# EAGLE design RGBCUBEv1.0 (EAGLE 5.11)
BOM: EXCLUDE; PARTNO: 114-00841-68

## Sheet 1 of 4
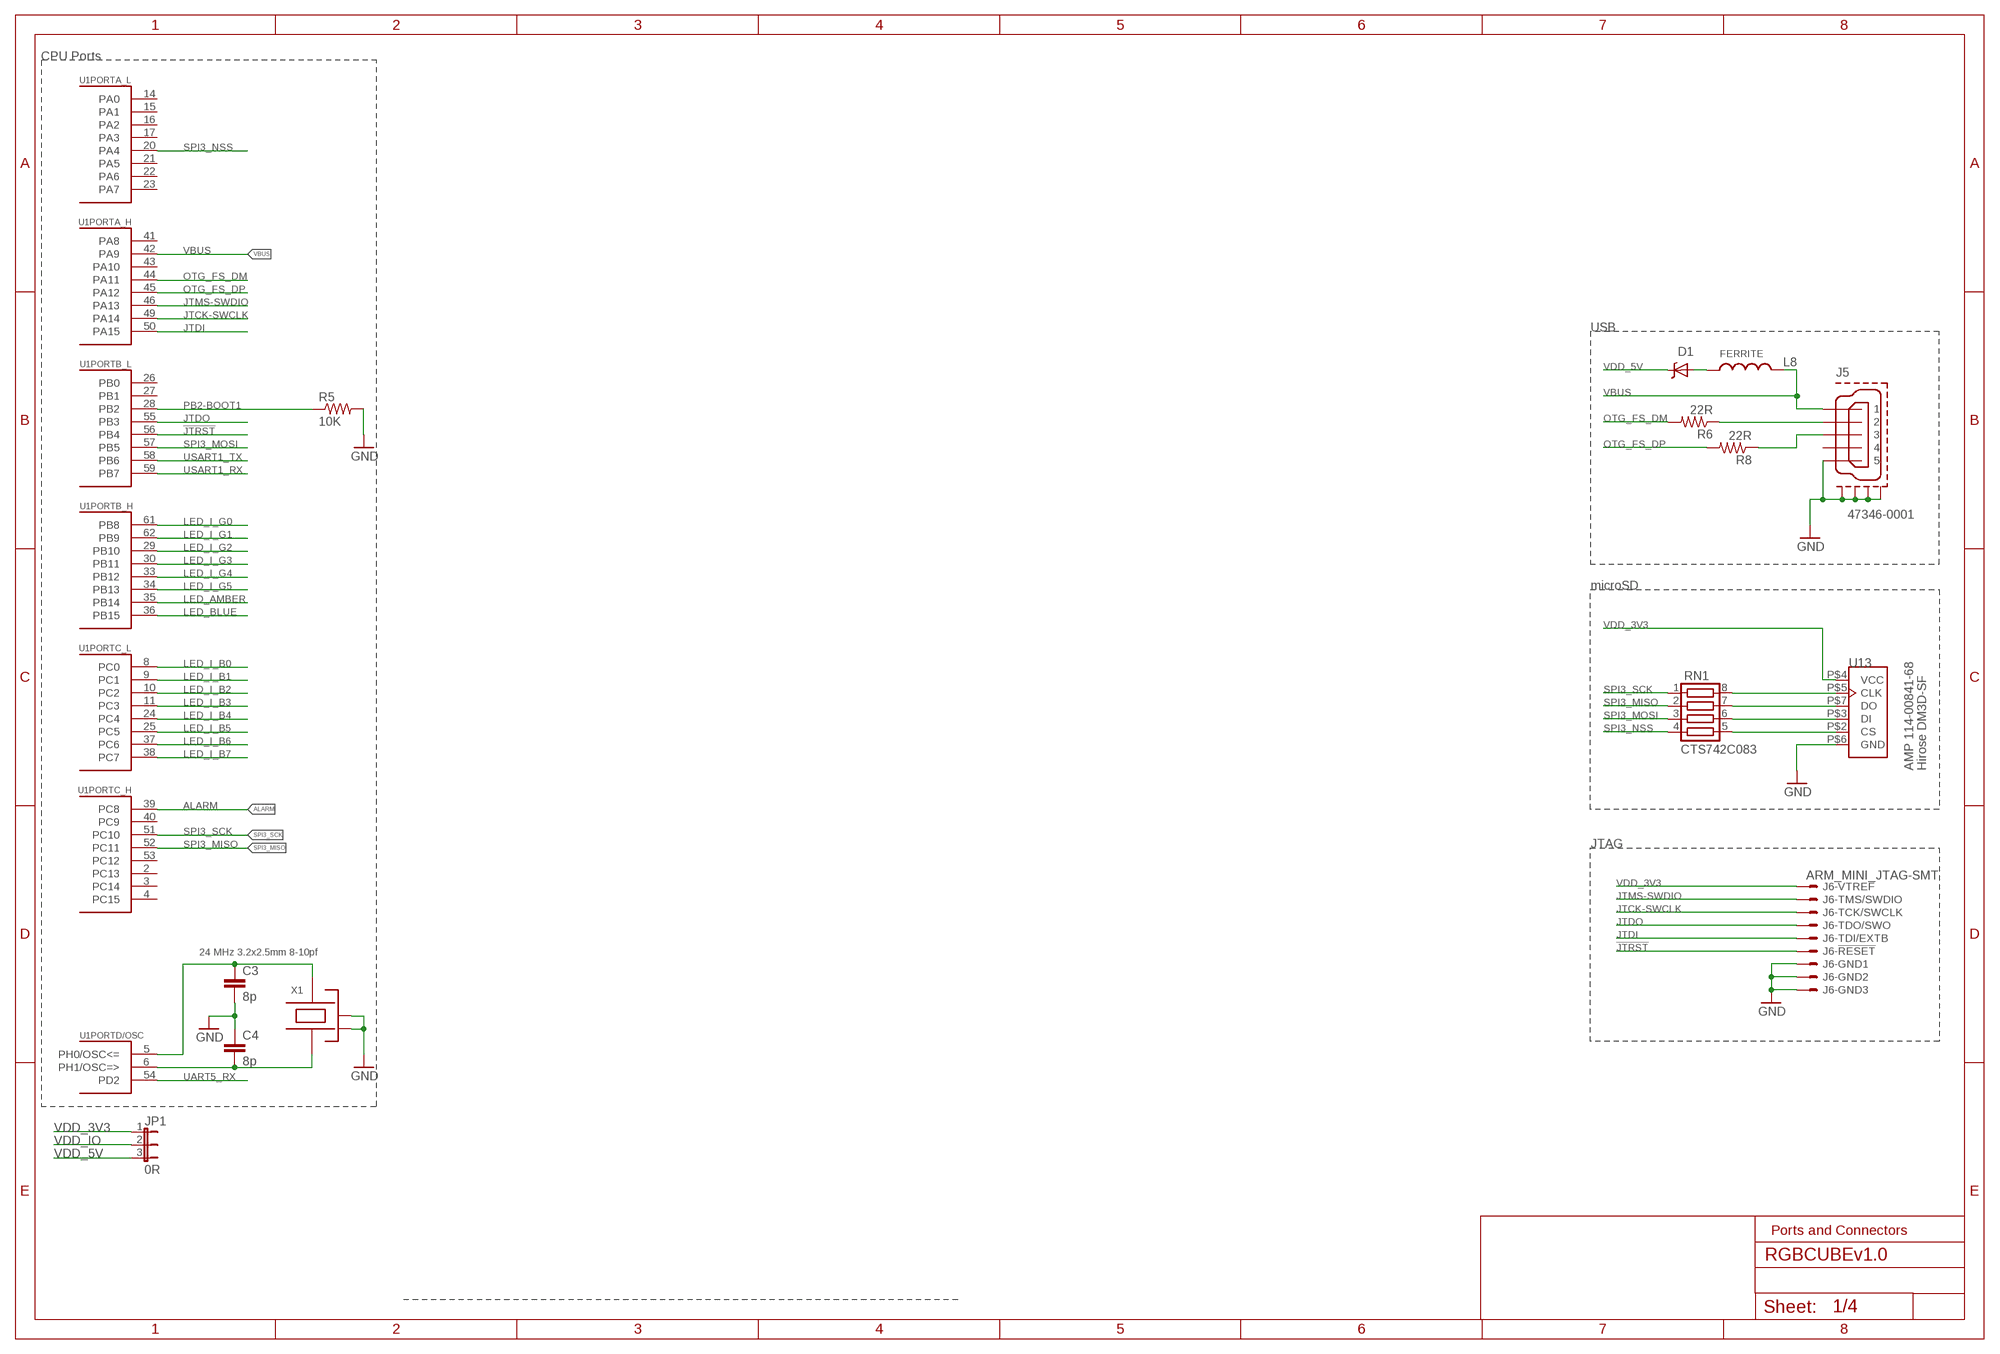
[diagram p0: schematic, sheet 1]

### Parts
C3  8p  CAP0402-CAP  [0402-CAP]
C4  8p  CAP0402-CAP  [0402-CAP]
D1  MSS1P4-M3  DIODE-SCHOTTKY_MSMP  [MICROSMP]
J5  47346-0001  MOLEX-47346-0001  [MOLEX-47346-0001]
J6  ARM_MINI_JTAG-SMT  [FTSH-105-01-XXX-DV-K]
JP1  0R  JUMPER-30603  [SJ_3_0603_PASTE1&2]
L8  FERRITE  INDUCTOR0402  [0402-IND]
R5  10K  RESISTOR0402-RES  [0402-RES]
R6  22R  RESISTOR0402-RES  [0402-RES]
R8  22R  RESISTOR0402-RES  [0402-RES]
RN1  CTS742C083  [CTS742C083]
U1  STM32F405RGT6  STM32F20X_TQFP64  [TQFP64]
U13  AMP 114-00841-68  SF-MICROSDAMP-114-00841-68  [AMPHENOL_114-00841-68]
X1  24 MHz 3.2x2.5mm 8-10pf  OSCILLATOR-3.2X2.5  [OSCILLATOR-3.2X2.5]

### Nets
!JTRST: J6.10 U1.56(PORTB_L:PB4)
ALARM: U1.39(PORTC_H:PC8)
GND [power]: C3.2 C4.1 J5.GND J5.GND1 J5.GND2 J5.GND3 J5.GND4 J6.3 J6.5 J6.9 R5.2 U13.P$6(GND) X1.2(NC_2) X1.4(NC_4) ; also sheet 2,3,4
JTCK-SWCLK: J6.4 U1.49(PORTA_H:PA14)
JTDI: J6.8 U1.50(PORTA_H:PA15)
JTDO: J6.6 U1.55(PORTB_L:PB3)
JTMS-SWDIO: J6.2 U1.46(PORTA_H:PA13)
LED_AMBER: U1.35(PORTB_H:PB14) ; also sheet 2
LED_BLUE: U1.36(PORTB_H:PB15) ; also sheet 2
LED_I_B0: U1.8(PORTC_L:PC0) ; also sheet 4
LED_I_B1: U1.9(PORTC_L:PC1) ; also sheet 4
LED_I_B2: U1.10(PORTC_L:PC2) ; also sheet 4
LED_I_B3: U1.11(PORTC_L:PC3) ; also sheet 4
LED_I_B4: U1.24(PORTC_L:PC4) ; also sheet 4
LED_I_B5: U1.25(PORTC_L:PC5) ; also sheet 4
LED_I_B6: U1.37(PORTC_L:PC6) ; also sheet 4
LED_I_B7: U1.38(PORTC_L:PC7) ; also sheet 4
LED_I_G0: U1.61(PORTB_H:PB8) ; also sheet 4
LED_I_G1: U1.62(PORTB_H:PB9) ; also sheet 4
LED_I_G2: U1.29(PORTB_H:PB10) ; also sheet 4
LED_I_G3: U1.30(PORTB_H:PB11) ; also sheet 4
LED_I_G4: U1.33(PORTB_H:PB12) ; also sheet 4
LED_I_G5: U1.34(PORTB_H:PB13) ; also sheet 4
N$1: C4.2 U1.6(PORTD/OSC:PH1/OSC=>) X1.1
N$2: C3.1 U1.5(PORTD/OSC:PH0/OSC<=) X1.3
N$21: RN1.5 U13.P$2(CS)
N$23 [power]: D1.ANODE(A) L8.1
N$26: RN1.6 U13.P$3(DI)
N$31: RN1.7 U13.P$7(DO)
N$32: RN1.8 U13.P$5(CLK)
OTG_DM: J5.D- R6.1
OTG_DP: J5.D+ R8.1
OTG_FS_DM: R6.2 U1.44(PORTA_H:PA11)
OTG_FS_DP: R8.2 U1.45(PORTA_H:PA12)
PB2-BOOT1: R5.1 U1.28(PORTB_L:PB2)
SPI3_MISO: RN1.2 U1.52(PORTC_H:PC11)
SPI3_MOSI: RN1.3 U1.57(PORTB_L:PB5)
SPI3_NSS: RN1.4 U1.20(PORTA_L:PA4)
SPI3_SCK: RN1.1 U1.51(PORTC_H:PC10)
UART5_RX: U1.54(PORTD/OSC:PD2)
USART1_RX: U1.59(PORTB_L:PB7)
USART1_TX: U1.58(PORTB_L:PB6)
VBUS [power]: J5.VBUS L8.2 U1.42(PORTA_H:PA9)
VDD_3V3 [power]: J6.1 JP1.1 U13.P$4(VCC) ; also sheet 2
VDD_5V [power]: D1.CATHODE(C) JP1.3 ; also sheet 2,3,4
VDD_IO [power]: JP1.2
Unconnected: J5.ID U1.2(PORTC_H:PC13) U1.3(PORTC_H:PC14) U1.4(PORTC_H:PC15) U1.14(PORTA_L:PA0) U1.15(PORTA_L:PA1) U1.16(PORTA_L:PA2) U1.17(PORTA_L:PA3) U1.21(PORTA_L:PA5) U1.22(PORTA_L:PA6) U1.23(PORTA_L:PA7) U1.26(PORTB_L:PB0) U1.27(PORTB_L:PB1) U1.40(PORTC_H:PC9) U1.41(PORTA_H:PA8) U1.43(PORTA_H:PA10) U1.53(PORTC_H:PC12)

### Notes on the sheet
- CPU Ports
- USB
- microSD
- Hirose DM3D-SF
- JTAG
- Ports and Connectors

## Sheet 2 of 4
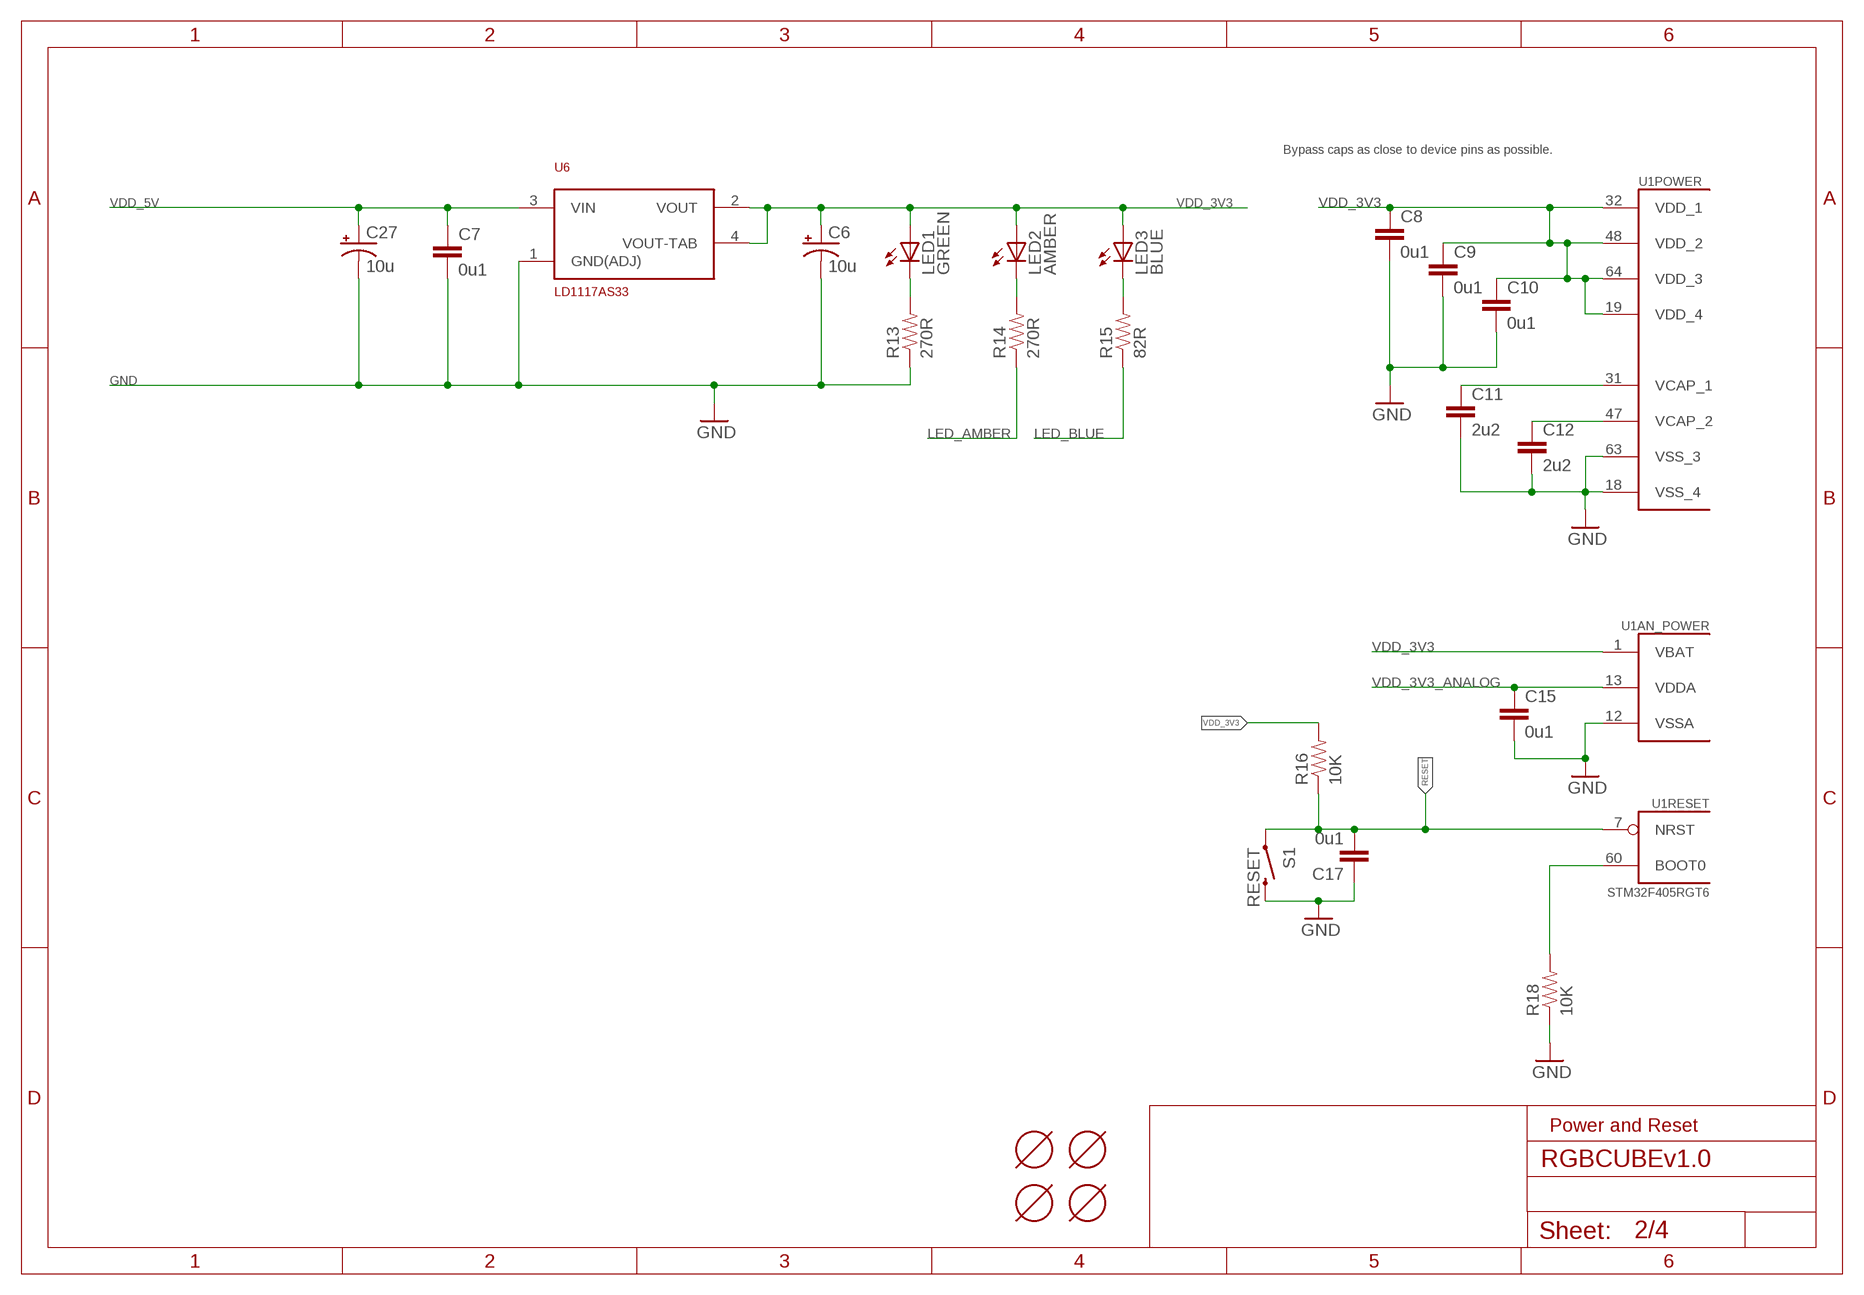
[diagram p1: schematic, sheet 2]

### Parts
C6  10u  CAP_POL1206  [EIA3216]
C7  0u1  CAP0402-CAP  [0402-CAP]
C8  0u1  CAP0402-CAP  [0402-CAP]
C9  0u1  CAP0402-CAP  [0402-CAP]
C10  0u1  CAP0402-CAP  [0402-CAP]
C11  2u2  CAP0402-CAP  [0402-CAP]
C12  2u2  CAP0402-CAP  [0402-CAP]
C15  0u1  CAP0402-CAP  [0402-CAP]
C17  0u1  CAP0402-CAP  [0402-CAP]
C27  10u  CAP_POL1206  [EIA3216]
LED1  GREEN  LED0603  [LED-0603]
LED2  AMBER  LED0603  [LED-0603]
LED3  BLUE  LED0603  [LED-0603]
R13  270R  RESISTOR0402-RES  [0402-RES]
R14  270R  RESISTOR0402-RES  [0402-RES]
R15  82R  RESISTOR0402-RES  [0402-RES]
R16  10K  RESISTOR0402-RES  [0402-RES]
R18  10K  RESISTOR0402-RES  [0402-RES]
S1  RESET  SWITCH-MOMENTARY-2  [EVQP7J01K]
U6  LD1117AS33  [SOT-223]
U$1  MOUNT-HOLE3.1MM  [MOUNT-HOLE3.1]
U$2  MOUNT-HOLE3.1MM  [MOUNT-HOLE3.1]
U$3  MOUNT-HOLE3.1MM  [MOUNT-HOLE3.1]
U$4  MOUNT-HOLE3.1MM  [MOUNT-HOLE3.1]

### Nets
BOOT0: R18.2 U1.60(RESET:BOOT0)
GND [power]: C6.C(-) C7.2 C8.2 C9.2 C10.2 C11.2 C12.2 C15.2 C17.1 C27.C(-) R13.1 R18.1 S1.B3 U1.12(AN_POWER:VSSA) U1.18(POWER:VSS_4) U1.63(POWER:VSS_3) U6.1(GND(ADJ)) ; also sheet 1,3,4
LED_AMBER: R14.1 ; also sheet 1
LED_BLUE: R15.1 ; also sheet 1
N$28: LED3.C R15.2
N$29: LED1.C R13.2
N$30: LED2.C R14.2
RESET: C17.2 R16.1 S1.A1 U1.7(RESET:NRST)
VCAP_1: C11.1 U1.31(POWER:VCAP_1)
VCAP_2: C12.1 U1.47(POWER:VCAP_2)
VDD_3V3 [power]: C6.A(+) C8.1 C9.1 C10.1 LED1.A LED2.A LED3.A R16.2 U1.1(AN_POWER:VBAT) U1.19(POWER:VDD_4) U1.32(POWER:VDD_1) U1.48(POWER:VDD_2) U1.64(POWER:VDD_3) U6.2(VOUT) U6.4(VOUT-TAB) ; also sheet 1
VDD_3V3_ANALOG [power]: C15.1 U1.13(AN_POWER:VDDA)
VDD_5V [power]: C7.1 C27.A(+) U6.3(VIN) ; also sheet 1,3,4

### Notes on the sheet
- Bypass caps as close to device pins as possible.
- Power and Reset

## Sheet 3 of 4
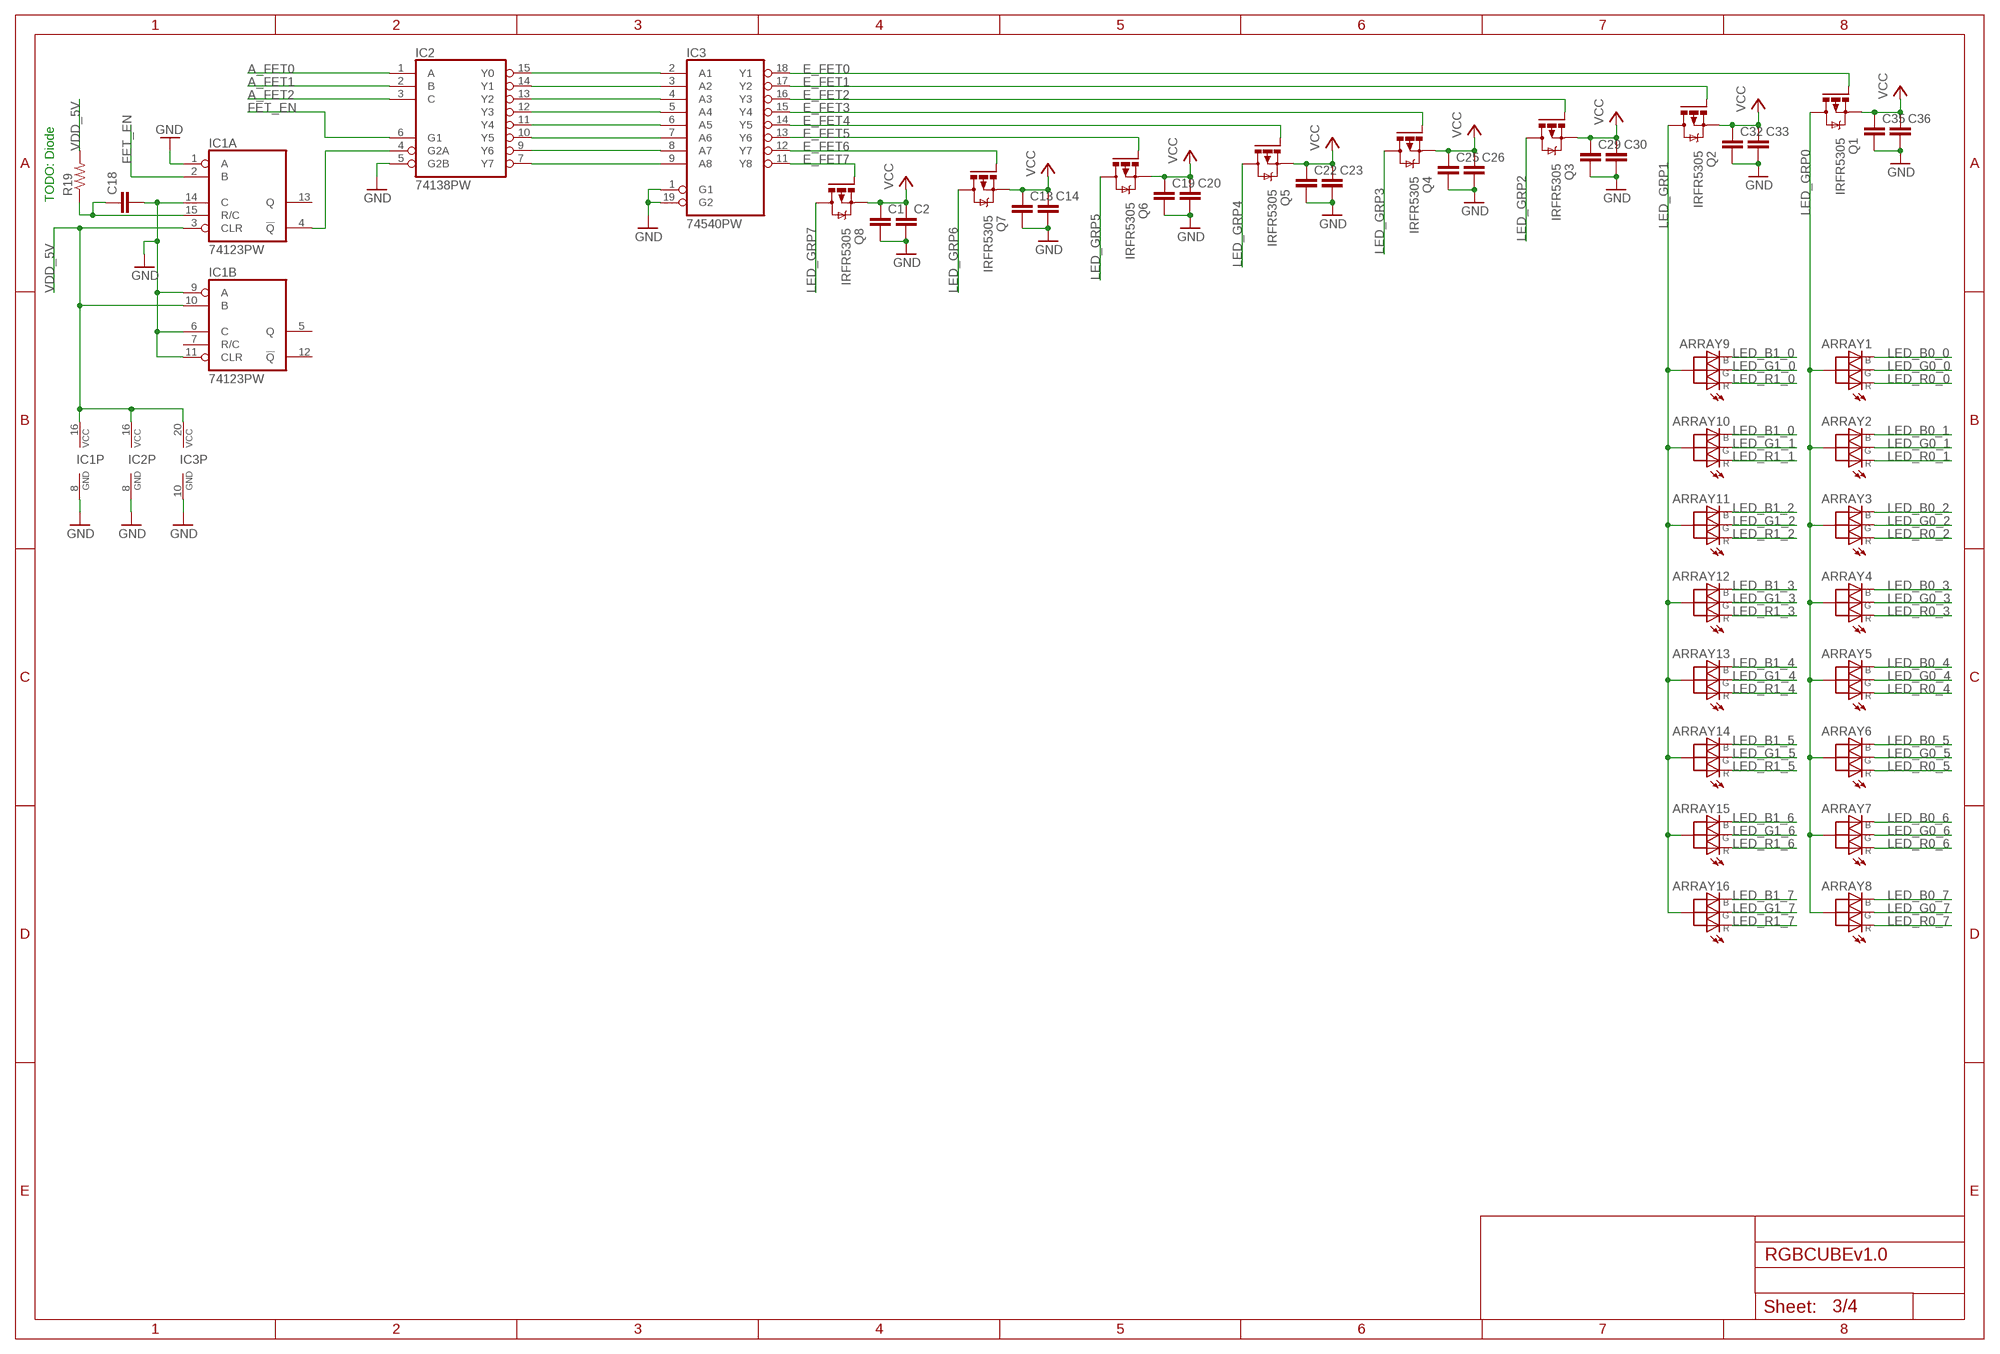
[diagram p2: schematic, sheet 3]

### Parts
ARRAY1  LED_RGB_5MMRAD  [LED_RGB_5MM_RAD]
ARRAY2  LED_RGB_5MMRAD  [LED_RGB_5MM_RAD]
ARRAY3  LED_RGB_5MMRAD  [LED_RGB_5MM_RAD]
ARRAY4  LED_RGB_5MMRAD  [LED_RGB_5MM_RAD]
ARRAY5  LED_RGB_5MMRAD  [LED_RGB_5MM_RAD]
ARRAY6  LED_RGB_5MMRAD  [LED_RGB_5MM_RAD]
ARRAY7  LED_RGB_5MMRAD  [LED_RGB_5MM_RAD]
ARRAY8  LED_RGB_5MMRAD  [LED_RGB_5MM_RAD]
ARRAY9  LED_RGB_5MMRAD  [LED_RGB_5MM_RAD]
ARRAY10  LED_RGB_5MMRAD  [LED_RGB_5MM_RAD]
ARRAY11  LED_RGB_5MMRAD  [LED_RGB_5MM_RAD]
ARRAY12  LED_RGB_5MMRAD  [LED_RGB_5MM_RAD]
ARRAY13  LED_RGB_5MMRAD  [LED_RGB_5MM_RAD]
ARRAY14  LED_RGB_5MMRAD  [LED_RGB_5MM_RAD]
ARRAY15  LED_RGB_5MMRAD  [LED_RGB_5MM_RAD]
ARRAY16  LED_RGB_5MMRAD  [LED_RGB_5MM_RAD]
C1  CAP0805  [0805]
C2  CAP0805  [0805]
C13  CAP0805  [0805]
C14  CAP0805  [0805]
C18  C-EUC0402  [C0402]
C19  CAP0805  [0805]
C20  CAP0805  [0805]
C22  CAP0805  [0805]
C23  CAP0805  [0805]
C25  CAP0805  [0805]
C26  CAP0805  [0805]
C29  CAP0805  [0805]
C30  CAP0805  [0805]
C32  CAP0805  [0805]
C33  CAP0805  [0805]
C35  CAP0805  [0805]
C36  CAP0805  [0805]
IC1  74123PW  [TSSOP-16]
IC2  74138PW  [TSSOP-16]
IC3  74540PW  [TSSOP-20]
Q1  IRFR5305  [D-PAK_TO252AA]
Q2  IRFR5305  [D-PAK_TO252AA]
Q3  IRFR5305  [D-PAK_TO252AA]
Q4  IRFR5305  [D-PAK_TO252AA]
Q5  IRFR5305  [D-PAK_TO252AA]
Q6  IRFR5305  [D-PAK_TO252AA]
Q7  IRFR5305  [D-PAK_TO252AA]
Q8  IRFR5305  [D-PAK_TO252AA]
R19  RESISTOR  [0805]

### Nets
A_FET0: IC2.1(A)
A_FET1: IC2.2(B)
A_FET2: IC2.3(C)
E_FET0: IC3.18(:Y1) Q1.1(G)
E_FET1: IC3.17(:Y2) Q2.1(G)
E_FET2: IC3.16(:Y3) Q3.1(G)
E_FET3: IC3.15(:Y4) Q4.1(G)
E_FET4: IC3.14(:Y5) Q5.1(G)
E_FET5: IC3.13(:Y6) Q6.1(G)
E_FET6: IC3.12(:Y7) Q7.1(G)
E_FET7: IC3.11(:Y8) Q8.1(G)
FET_EN: IC1.2(A:B) IC2.6(G1)
GND [power]: C1.2 C2.2 C13.2 C14.2 C18.2 C19.2 C20.2 C22.2 C23.2 C25.2 C26.2 C29.2 C30.2 C32.2 C33.2 C35.2 C36.2 IC1.1(A:A) IC1.6(B:C) IC1.8(P:GND) IC1.9(B:A) IC1.11(B:CLR) IC1.14(A:C) IC2.5(G2B) IC2.8(GND) IC3.1(:G1) IC3.10(P:GND) IC3.19(:G2) ; also sheet 1,2,4
LED_B0_0: ARRAY1.B ; also sheet 4
LED_B0_1: ARRAY2.B ; also sheet 4
LED_B0_2: ARRAY3.B ; also sheet 4
LED_B0_3: ARRAY4.B ; also sheet 4
LED_B0_4: ARRAY5.B ; also sheet 4
LED_B0_5: ARRAY6.B ; also sheet 4
LED_B0_6: ARRAY7.B ; also sheet 4
LED_B0_7: ARRAY8.B ; also sheet 4
LED_B1_0: ARRAY9.B ARRAY10.B ; also sheet 4
LED_B1_2: ARRAY11.B ; also sheet 4
LED_B1_3: ARRAY12.B ; also sheet 4
LED_B1_4: ARRAY13.B ; also sheet 4
LED_B1_5: ARRAY14.B ; also sheet 4
LED_B1_6: ARRAY15.B ; also sheet 4
LED_B1_7: ARRAY16.B ; also sheet 4
LED_G0_0: ARRAY1.G ; also sheet 4
LED_G0_1: ARRAY2.G ; also sheet 4
LED_G0_2: ARRAY3.G ; also sheet 4
LED_G0_3: ARRAY4.G ; also sheet 4
LED_G0_4: ARRAY5.G ; also sheet 4
LED_G0_5: ARRAY6.G ; also sheet 4
LED_G0_6: ARRAY7.G ; also sheet 4
LED_G0_7: ARRAY8.G ; also sheet 4
LED_G1_0: ARRAY9.G ; also sheet 4
LED_G1_1: ARRAY10.G ; also sheet 4
LED_G1_2: ARRAY11.G ; also sheet 4
LED_G1_3: ARRAY12.G ; also sheet 4
LED_G1_4: ARRAY13.G ; also sheet 4
LED_G1_5: ARRAY14.G ; also sheet 4
LED_G1_6: ARRAY15.G ; also sheet 4
LED_G1_7: ARRAY16.G ; also sheet 4
LED_GRP0: ARRAY1.A ARRAY2.A ARRAY3.A ARRAY4.A ARRAY5.A ARRAY6.A ARRAY7.A ARRAY8.A Q1.4(D)
LED_GRP1: ARRAY9.A ARRAY10.A ARRAY11.A ARRAY12.A ARRAY13.A ARRAY14.A ARRAY15.A ARRAY16.A Q2.4(D)
LED_GRP2: Q3.4(D)
LED_GRP3: Q4.4(D)
LED_GRP4: Q5.4(D)
LED_GRP5: Q6.4(D)
LED_GRP6: Q7.4(D)
LED_GRP7: Q8.4(D)
LED_R0_0: ARRAY1.R ; also sheet 4
LED_R0_1: ARRAY2.R ; also sheet 4
LED_R0_2: ARRAY3.R ; also sheet 4
LED_R0_3: ARRAY4.R ; also sheet 4
LED_R0_4: ARRAY5.R ; also sheet 4
LED_R0_5: ARRAY6.R ; also sheet 4
LED_R0_6: ARRAY7.R ; also sheet 4
LED_R0_7: ARRAY8.R ; also sheet 4
LED_R1_0: ARRAY9.R ; also sheet 4
LED_R1_1: ARRAY10.R ; also sheet 4
LED_R1_2: ARRAY11.R ; also sheet 4
LED_R1_3: ARRAY12.R ; also sheet 4
LED_R1_4: ARRAY13.R ; also sheet 4
LED_R1_5: ARRAY14.R ; also sheet 4
LED_R1_6: ARRAY15.R ; also sheet 4
LED_R1_7: ARRAY16.R ; also sheet 4
N$3: IC2.15(Y0) IC3.2(:A1)
N$6: IC2.13(Y2) IC3.4(:A3)
N$10: IC2.12(Y3) IC3.5(:A4)
N$19: IC2.11(Y4) IC3.6(:A5)
N$36: IC2.14(Y1) IC3.3(:A2)
N$40: IC2.10(Y5) IC3.7(:A6)
N$42: IC2.9(Y6) IC3.8(:A7)
N$43: IC2.7(Y7) IC3.9(:A8)
N$45: IC1.4(A:!Q) IC2.4(G2A)
N$47: C18.1 IC1.15(A:R/C) R19.1
VCC: C1.1 C2.1 C13.1 C14.1 C19.1 C20.1 C22.1 C23.1 C25.1 C26.1 C29.1 C30.1 C32.1 C33.1 C35.1 C36.1 Q1.3(S) Q2.3(S) Q3.3(S) Q4.3(S) Q5.3(S) Q6.3(S) Q7.3(S) Q8.3(S)
VDD_5V [power]: IC1.3(A:CLR) IC1.10(B:B) IC1.16(P:VCC) IC2.16(VCC) IC3.20(P:VCC) R19.2 ; also sheet 1,2,4
Unconnected: IC1.5(B:Q) IC1.7(B:R/C) IC1.12(B:!Q) IC1.13(A:Q)

### Notes on the sheet
- TODO: Diode

## Sheet 4 of 4
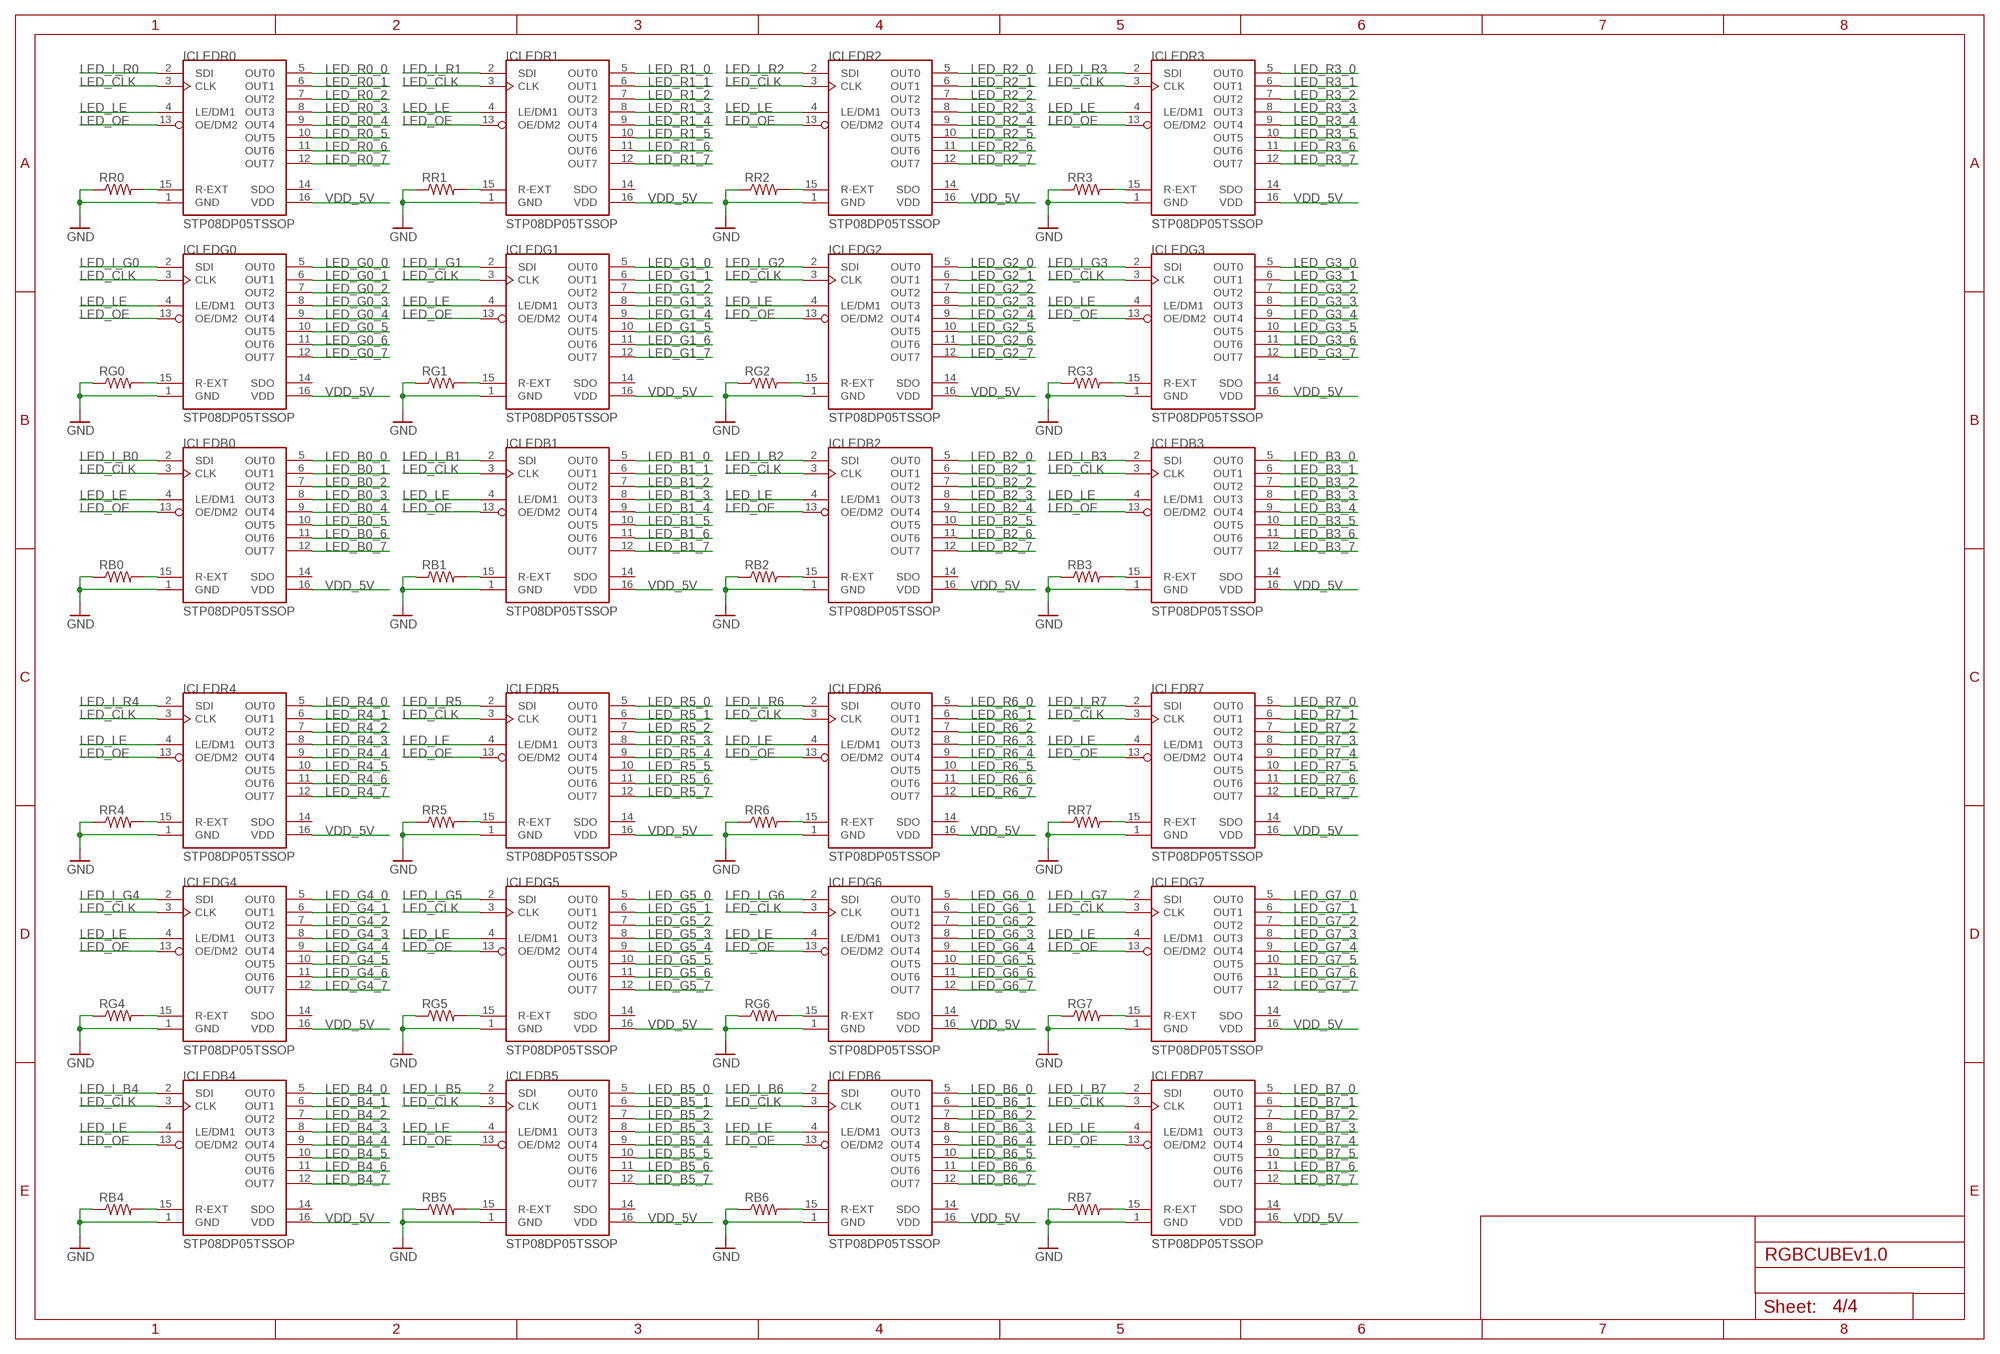
[diagram p3: schematic, sheet 4]

### Parts
ICLEDB0  STP08DP05TSSOP  [TSSOP-16]
ICLEDB1  STP08DP05TSSOP  [TSSOP-16]
ICLEDB2  STP08DP05TSSOP  [TSSOP-16]
ICLEDB3  STP08DP05TSSOP  [TSSOP-16]
ICLEDB4  STP08DP05TSSOP  [TSSOP-16]
ICLEDB5  STP08DP05TSSOP  [TSSOP-16]
ICLEDB6  STP08DP05TSSOP  [TSSOP-16]
ICLEDB7  STP08DP05TSSOP  [TSSOP-16]
ICLEDG0  STP08DP05TSSOP  [TSSOP-16]
ICLEDG1  STP08DP05TSSOP  [TSSOP-16]
ICLEDG2  STP08DP05TSSOP  [TSSOP-16]
ICLEDG3  STP08DP05TSSOP  [TSSOP-16]
ICLEDG4  STP08DP05TSSOP  [TSSOP-16]
ICLEDG5  STP08DP05TSSOP  [TSSOP-16]
ICLEDG6  STP08DP05TSSOP  [TSSOP-16]
ICLEDG7  STP08DP05TSSOP  [TSSOP-16]
ICLEDR0  STP08DP05TSSOP  [TSSOP-16]
ICLEDR1  STP08DP05TSSOP  [TSSOP-16]
ICLEDR2  STP08DP05TSSOP  [TSSOP-16]
ICLEDR3  STP08DP05TSSOP  [TSSOP-16]
ICLEDR4  STP08DP05TSSOP  [TSSOP-16]
ICLEDR5  STP08DP05TSSOP  [TSSOP-16]
ICLEDR6  STP08DP05TSSOP  [TSSOP-16]
ICLEDR7  STP08DP05TSSOP  [TSSOP-16]
RB0  RESISTOR0402-RES  [0402-RES]
RB1  RESISTOR0402-RES  [0402-RES]
RB2  RESISTOR0402-RES  [0402-RES]
RB3  RESISTOR0402-RES  [0402-RES]
RB4  RESISTOR0402-RES  [0402-RES]
RB5  RESISTOR0402-RES  [0402-RES]
RB6  RESISTOR0402-RES  [0402-RES]
RB7  RESISTOR0402-RES  [0402-RES]
RG0  RESISTOR0402-RES  [0402-RES]
RG1  RESISTOR0402-RES  [0402-RES]
RG2  RESISTOR0402-RES  [0402-RES]
RG3  RESISTOR0402-RES  [0402-RES]
RG4  RESISTOR0402-RES  [0402-RES]
RG5  RESISTOR0402-RES  [0402-RES]
RG6  RESISTOR0402-RES  [0402-RES]
RG7  RESISTOR0402-RES  [0402-RES]
RR0  RESISTOR0402-RES  [0402-RES]
RR1  RESISTOR0402-RES  [0402-RES]
RR2  RESISTOR0402-RES  [0402-RES]
RR3  RESISTOR0402-RES  [0402-RES]
RR4  RESISTOR0402-RES  [0402-RES]
RR5  RESISTOR0402-RES  [0402-RES]
RR6  RESISTOR0402-RES  [0402-RES]
RR7  RESISTOR0402-RES  [0402-RES]

### Nets
GND [power]: ICLEDB0.1(GND) ICLEDB1.1(GND) ICLEDB2.1(GND) ICLEDB3.1(GND) ICLEDB4.1(GND) ICLEDB5.1(GND) ICLEDB6.1(GND) ICLEDB7.1(GND) ICLEDG0.1(GND) ICLEDG1.1(GND) ICLEDG2.1(GND) ICLEDG3.1(GND) ICLEDG4.1(GND) ICLEDG5.1(GND) ICLEDG6.1(GND) ICLEDG7.1(GND) ICLEDR0.1(GND) ICLEDR1.1(GND) ICLEDR2.1(GND) ICLEDR3.1(GND) ICLEDR4.1(GND) ICLEDR5.1(GND) ICLEDR6.1(GND) ICLEDR7.1(GND) RB0.1 RB1.1 RB2.1 RB3.1 RB4.1 RB5.1 RB6.1 RB7.1 RG0.1 RG1.1 RG2.1 RG3.1 RG4.1 RG5.1 RG6.1 RG7.1 RR0.1 RR1.1 RR2.1 RR3.1 RR4.1 RR5.1 RR6.1 RR7.1 ; also sheet 1,2,3
LED_B0_0: ICLEDB0.5(OUT0) ; also sheet 3
LED_B0_1: ICLEDB0.6(OUT1) ; also sheet 3
LED_B0_2: ICLEDB0.7(OUT2) ; also sheet 3
LED_B0_3: ICLEDB0.8(OUT3) ; also sheet 3
LED_B0_4: ICLEDB0.9(OUT4) ; also sheet 3
LED_B0_5: ICLEDB0.10(OUT5) ; also sheet 3
LED_B0_6: ICLEDB0.11(OUT6) ; also sheet 3
LED_B0_7: ICLEDB0.12(OUT7) ; also sheet 3
LED_B1_0: ICLEDB1.5(OUT0) ; also sheet 3
LED_B1_1: ICLEDB1.6(OUT1)
LED_B1_2: ICLEDB1.7(OUT2) ; also sheet 3
LED_B1_3: ICLEDB1.8(OUT3) ; also sheet 3
LED_B1_4: ICLEDB1.9(OUT4) ; also sheet 3
LED_B1_5: ICLEDB1.10(OUT5) ; also sheet 3
LED_B1_6: ICLEDB1.11(OUT6) ; also sheet 3
LED_B1_7: ICLEDB1.12(OUT7) ; also sheet 3
LED_B2_0: ICLEDB2.5(OUT0)
LED_B2_1: ICLEDB2.6(OUT1)
LED_B2_2: ICLEDB2.7(OUT2)
LED_B2_3: ICLEDB2.8(OUT3)
LED_B2_4: ICLEDB2.9(OUT4)
LED_B2_5: ICLEDB2.10(OUT5)
LED_B2_6: ICLEDB2.11(OUT6)
LED_B2_7: ICLEDB2.12(OUT7)
LED_B3_0: ICLEDB3.5(OUT0)
LED_B3_1: ICLEDB3.6(OUT1)
LED_B3_2: ICLEDB3.7(OUT2)
LED_B3_3: ICLEDB3.8(OUT3)
LED_B3_4: ICLEDB3.9(OUT4)
LED_B3_5: ICLEDB3.10(OUT5)
LED_B3_6: ICLEDB3.11(OUT6)
LED_B3_7: ICLEDB3.12(OUT7)
LED_B4_0: ICLEDB4.5(OUT0)
LED_B4_1: ICLEDB4.6(OUT1)
LED_B4_2: ICLEDB4.7(OUT2)
LED_B4_3: ICLEDB4.8(OUT3)
LED_B4_4: ICLEDB4.9(OUT4)
LED_B4_5: ICLEDB4.10(OUT5)
LED_B4_6: ICLEDB4.11(OUT6)
LED_B4_7: ICLEDB4.12(OUT7)
LED_B5_0: ICLEDB5.5(OUT0)
LED_B5_1: ICLEDB5.6(OUT1)
LED_B5_2: ICLEDB5.7(OUT2)
LED_B5_3: ICLEDB5.8(OUT3)
LED_B5_4: ICLEDB5.9(OUT4)
LED_B5_5: ICLEDB5.10(OUT5)
LED_B5_6: ICLEDB5.11(OUT6)
LED_B5_7: ICLEDB5.12(OUT7)
LED_B6_0: ICLEDB6.5(OUT0)
LED_B6_1: ICLEDB6.6(OUT1)
LED_B6_2: ICLEDB6.7(OUT2)
LED_B6_3: ICLEDB6.8(OUT3)
LED_B6_4: ICLEDB6.9(OUT4)
LED_B6_5: ICLEDB6.10(OUT5)
LED_B6_6: ICLEDB6.11(OUT6)
LED_B6_7: ICLEDB6.12(OUT7)
LED_B7_0: ICLEDB7.5(OUT0)
LED_B7_1: ICLEDB7.6(OUT1)
LED_B7_2: ICLEDB7.7(OUT2)
LED_B7_3: ICLEDB7.8(OUT3)
LED_B7_4: ICLEDB7.9(OUT4)
LED_B7_5: ICLEDB7.10(OUT5)
LED_B7_6: ICLEDB7.11(OUT6)
LED_B7_7: ICLEDB7.12(OUT7)
LED_CLK: ICLEDB0.3(CLK) ICLEDB1.3(CLK) ICLEDB2.3(CLK) ICLEDB3.3(CLK) ICLEDB4.3(CLK) ICLEDB5.3(CLK) ICLEDB6.3(CLK) ICLEDB7.3(CLK) ICLEDG0.3(CLK) ICLEDG1.3(CLK) ICLEDG2.3(CLK) ICLEDG3.3(CLK) ICLEDG4.3(CLK) ICLEDG5.3(CLK) ICLEDG6.3(CLK) ICLEDG7.3(CLK) ICLEDR0.3(CLK) ICLEDR1.3(CLK) ICLEDR2.3(CLK) ICLEDR3.3(CLK) ICLEDR4.3(CLK) ICLEDR5.3(CLK) ICLEDR6.3(CLK) ICLEDR7.3(CLK)
LED_G0_0: ICLEDG0.5(OUT0) ; also sheet 3
LED_G0_1: ICLEDG0.6(OUT1) ; also sheet 3
LED_G0_2: ICLEDG0.7(OUT2) ; also sheet 3
LED_G0_3: ICLEDG0.8(OUT3) ; also sheet 3
LED_G0_4: ICLEDG0.9(OUT4) ; also sheet 3
LED_G0_5: ICLEDG0.10(OUT5) ; also sheet 3
LED_G0_6: ICLEDG0.11(OUT6) ; also sheet 3
LED_G0_7: ICLEDG0.12(OUT7) ; also sheet 3
LED_G1_0: ICLEDG1.5(OUT0) ; also sheet 3
LED_G1_1: ICLEDG1.6(OUT1) ; also sheet 3
LED_G1_2: ICLEDG1.7(OUT2) ; also sheet 3
LED_G1_3: ICLEDG1.8(OUT3) ; also sheet 3
LED_G1_4: ICLEDG1.9(OUT4) ; also sheet 3
LED_G1_5: ICLEDG1.10(OUT5) ; also sheet 3
LED_G1_6: ICLEDG1.11(OUT6) ; also sheet 3
LED_G1_7: ICLEDG1.12(OUT7) ; also sheet 3
LED_G2_0: ICLEDG2.5(OUT0)
LED_G2_1: ICLEDG2.6(OUT1)
LED_G2_2: ICLEDG2.7(OUT2)
LED_G2_3: ICLEDG2.8(OUT3)
LED_G2_4: ICLEDG2.9(OUT4)
LED_G2_5: ICLEDG2.10(OUT5)
LED_G2_6: ICLEDG2.11(OUT6)
LED_G2_7: ICLEDG2.12(OUT7)
LED_G3_0: ICLEDG3.5(OUT0)
LED_G3_1: ICLEDG3.6(OUT1)
LED_G3_2: ICLEDG3.7(OUT2)
LED_G3_3: ICLEDG3.8(OUT3)
LED_G3_4: ICLEDG3.9(OUT4)
LED_G3_5: ICLEDG3.10(OUT5)
LED_G3_6: ICLEDG3.11(OUT6)
LED_G3_7: ICLEDG3.12(OUT7)
LED_G4_0: ICLEDG4.5(OUT0)
LED_G4_1: ICLEDG4.6(OUT1)
LED_G4_2: ICLEDG4.7(OUT2)
LED_G4_3: ICLEDG4.8(OUT3)
LED_G4_4: ICLEDG4.9(OUT4)
LED_G4_5: ICLEDG4.10(OUT5)
LED_G4_6: ICLEDG4.11(OUT6)
LED_G4_7: ICLEDG4.12(OUT7)
LED_G5_0: ICLEDG5.5(OUT0)
LED_G5_1: ICLEDG5.6(OUT1)
LED_G5_2: ICLEDG5.7(OUT2)
LED_G5_3: ICLEDG5.8(OUT3)
LED_G5_4: ICLEDG5.9(OUT4)
LED_G5_5: ICLEDG5.10(OUT5)
LED_G5_6: ICLEDG5.11(OUT6)
LED_G5_7: ICLEDG5.12(OUT7)
LED_G6_0: ICLEDG6.5(OUT0)
LED_G6_1: ICLEDG6.6(OUT1)
LED_G6_2: ICLEDG6.7(OUT2)
LED_G6_3: ICLEDG6.8(OUT3)
LED_G6_4: ICLEDG6.9(OUT4)
LED_G6_5: ICLEDG6.10(OUT5)
LED_G6_6: ICLEDG6.11(OUT6)
LED_G6_7: ICLEDG6.12(OUT7)
LED_G7_0: ICLEDG7.5(OUT0)
LED_G7_1: ICLEDG7.6(OUT1)
LED_G7_2: ICLEDG7.7(OUT2)
LED_G7_3: ICLEDG7.8(OUT3)
LED_G7_4: ICLEDG7.9(OUT4)
LED_G7_5: ICLEDG7.10(OUT5)
LED_G7_6: ICLEDG7.11(OUT6)
LED_G7_7: ICLEDG7.12(OUT7)
LED_I_B0: ICLEDB0.2(SDI) ; also sheet 1
LED_I_B1: ICLEDB1.2(SDI) ; also sheet 1
LED_I_B2: ICLEDB2.2(SDI) ; also sheet 1
LED_I_B3: ICLEDB3.2(SDI) ; also sheet 1
LED_I_B4: ICLEDB4.2(SDI) ; also sheet 1
LED_I_B5: ICLEDB5.2(SDI) ; also sheet 1
LED_I_B6: ICLEDB6.2(SDI) ; also sheet 1
LED_I_B7: ICLEDB7.2(SDI) ; also sheet 1
LED_I_G0: ICLEDG0.2(SDI) ; also sheet 1
LED_I_G1: ICLEDG1.2(SDI) ; also sheet 1
LED_I_G2: ICLEDG2.2(SDI) ; also sheet 1
LED_I_G3: ICLEDG3.2(SDI) ; also sheet 1
LED_I_G4: ICLEDG4.2(SDI) ; also sheet 1
LED_I_G5: ICLEDG5.2(SDI) ; also sheet 1
LED_I_G6: ICLEDG6.2(SDI)
LED_I_G7: ICLEDG7.2(SDI)
LED_I_R0: ICLEDR0.2(SDI)
LED_I_R1: ICLEDR1.2(SDI)
LED_I_R2: ICLEDR2.2(SDI)
LED_I_R3: ICLEDR3.2(SDI)
LED_I_R4: ICLEDR4.2(SDI)
LED_I_R5: ICLEDR5.2(SDI)
LED_I_R6: ICLEDR6.2(SDI)
LED_I_R7: ICLEDR7.2(SDI)
LED_LE: ICLEDB0.4(LE/DM1) ICLEDB1.4(LE/DM1) ICLEDB2.4(LE/DM1) ICLEDB3.4(LE/DM1) ICLEDB4.4(LE/DM1) ICLEDB5.4(LE/DM1) ICLEDB6.4(LE/DM1) ICLEDB7.4(LE/DM1) ICLEDG0.4(LE/DM1) ICLEDG1.4(LE/DM1) ICLEDG2.4(LE/DM1) ICLEDG3.4(LE/DM1) ICLEDG4.4(LE/DM1) ICLEDG5.4(LE/DM1) ICLEDG6.4(LE/DM1) ICLEDG7.4(LE/DM1) ICLEDR0.4(LE/DM1) ICLEDR1.4(LE/DM1) ICLEDR2.4(LE/DM1) ICLEDR3.4(LE/DM1) ICLEDR4.4(LE/DM1) ICLEDR5.4(LE/DM1) ICLEDR6.4(LE/DM1) ICLEDR7.4(LE/DM1)
LED_OE: ICLEDB0.13(OE/DM2) ICLEDB1.13(OE/DM2) ICLEDB2.13(OE/DM2) ICLEDB3.13(OE/DM2) ICLEDB4.13(OE/DM2) ICLEDB5.13(OE/DM2) ICLEDB6.13(OE/DM2) ICLEDB7.13(OE/DM2) ICLEDG0.13(OE/DM2) ICLEDG1.13(OE/DM2) ICLEDG2.13(OE/DM2) ICLEDG3.13(OE/DM2) ICLEDG4.13(OE/DM2) ICLEDG5.13(OE/DM2) ICLEDG6.13(OE/DM2) ICLEDG7.13(OE/DM2) ICLEDR0.13(OE/DM2) ICLEDR1.13(OE/DM2) ICLEDR2.13(OE/DM2) ICLEDR3.13(OE/DM2) ICLEDR4.13(OE/DM2) ICLEDR5.13(OE/DM2) ICLEDR6.13(OE/DM2) ICLEDR7.13(OE/DM2)
LED_R0_0: ICLEDR0.5(OUT0) ; also sheet 3
LED_R0_1: ICLEDR0.6(OUT1) ; also sheet 3
LED_R0_2: ICLEDR0.7(OUT2) ; also sheet 3
LED_R0_3: ICLEDR0.8(OUT3) ; also sheet 3
LED_R0_4: ICLEDR0.9(OUT4) ; also sheet 3
LED_R0_5: ICLEDR0.10(OUT5) ; also sheet 3
LED_R0_6: ICLEDR0.11(OUT6) ; also sheet 3
LED_R0_7: ICLEDR0.12(OUT7) ; also sheet 3
LED_R1_0: ICLEDR1.5(OUT0) ; also sheet 3
LED_R1_1: ICLEDR1.6(OUT1) ; also sheet 3
LED_R1_2: ICLEDR1.7(OUT2) ; also sheet 3
LED_R1_3: ICLEDR1.8(OUT3) ; also sheet 3
LED_R1_4: ICLEDR1.9(OUT4) ; also sheet 3
LED_R1_5: ICLEDR1.10(OUT5) ; also sheet 3
LED_R1_6: ICLEDR1.11(OUT6) ; also sheet 3
LED_R1_7: ICLEDR1.12(OUT7) ; also sheet 3
LED_R2_0: ICLEDR2.5(OUT0)
LED_R2_1: ICLEDR2.6(OUT1)
LED_R2_2: ICLEDR2.7(OUT2)
LED_R2_3: ICLEDR2.8(OUT3)
LED_R2_4: ICLEDR2.9(OUT4)
LED_R2_5: ICLEDR2.10(OUT5)
LED_R2_6: ICLEDR2.11(OUT6)
LED_R2_7: ICLEDR2.12(OUT7)
LED_R3_0: ICLEDR3.5(OUT0)
LED_R3_1: ICLEDR3.6(OUT1)
LED_R3_2: ICLEDR3.7(OUT2)
LED_R3_3: ICLEDR3.8(OUT3)
LED_R3_4: ICLEDR3.9(OUT4)
LED_R3_5: ICLEDR3.10(OUT5)
LED_R3_6: ICLEDR3.11(OUT6)
LED_R3_7: ICLEDR3.12(OUT7)
LED_R4_0: ICLEDR4.5(OUT0)
LED_R4_1: ICLEDR4.6(OUT1)
LED_R4_2: ICLEDR4.7(OUT2)
LED_R4_3: ICLEDR4.8(OUT3)
LED_R4_4: ICLEDR4.9(OUT4)
LED_R4_5: ICLEDR4.10(OUT5)
LED_R4_6: ICLEDR4.11(OUT6)
LED_R4_7: ICLEDR4.12(OUT7)
LED_R5_0: ICLEDR5.5(OUT0)
LED_R5_1: ICLEDR5.6(OUT1)
LED_R5_2: ICLEDR5.7(OUT2)
LED_R5_3: ICLEDR5.8(OUT3)
LED_R5_4: ICLEDR5.9(OUT4)
LED_R5_5: ICLEDR5.10(OUT5)
LED_R5_6: ICLEDR5.11(OUT6)
LED_R5_7: ICLEDR5.12(OUT7)
LED_R6_0: ICLEDR6.5(OUT0)
LED_R6_1: ICLEDR6.6(OUT1)
LED_R6_2: ICLEDR6.7(OUT2)
LED_R6_3: ICLEDR6.8(OUT3)
LED_R6_4: ICLEDR6.9(OUT4)
LED_R6_5: ICLEDR6.10(OUT5)
LED_R6_6: ICLEDR6.11(OUT6)
LED_R6_7: ICLEDR6.12(OUT7)
LED_R7_0: ICLEDR7.5(OUT0)
LED_R7_1: ICLEDR7.6(OUT1)
LED_R7_2: ICLEDR7.7(OUT2)
LED_R7_3: ICLEDR7.8(OUT3)
LED_R7_4: ICLEDR7.9(OUT4)
LED_R7_5: ICLEDR7.10(OUT5)
LED_R7_6: ICLEDR7.11(OUT6)
LED_R7_7: ICLEDR7.12(OUT7)
N$4 [power]: ICLEDR0.15(R-EXT) RR0.2
N$5: ICLEDG1.15(R-EXT) RG1.2
N$8: ICLEDB1.15(R-EXT) RB1.2
N$9 [power]: ICLEDR1.15(R-EXT) RR1.2
N$11: ICLEDG2.15(R-EXT) RG2.2
N$12: ICLEDB2.15(R-EXT) RB2.2
N$13: ICLEDG0.15(R-EXT) RG0.2
N$14 [power]: ICLEDR2.15(R-EXT) RR2.2
N$15: ICLEDB0.15(R-EXT) RB0.2
N$16: ICLEDG3.15(R-EXT) RG3.2
N$18: ICLEDB3.15(R-EXT) RB3.2
N$20 [power]: ICLEDR3.15(R-EXT) RR3.2
N$24: ICLEDG4.15(R-EXT) RG4.2
N$25: ICLEDB4.15(R-EXT) RB4.2
N$27 [power]: ICLEDR4.15(R-EXT) RR4.2
N$35: ICLEDG5.15(R-EXT) RG5.2
N$41: ICLEDB5.15(R-EXT) RB5.2
N$46 [power]: ICLEDR5.15(R-EXT) RR5.2
N$48: ICLEDG6.15(R-EXT) RG6.2
N$49: ICLEDB6.15(R-EXT) RB6.2
N$50 [power]: ICLEDR6.15(R-EXT) RR6.2
N$51: ICLEDG7.15(R-EXT) RG7.2
N$52: ICLEDB7.15(R-EXT) RB7.2
N$53 [power]: ICLEDR7.15(R-EXT) RR7.2
VDD_5V [power]: ICLEDB0.16(VDD) ICLEDB1.16(VDD) ICLEDB2.16(VDD) ICLEDB3.16(VDD) ICLEDB4.16(VDD) ICLEDB5.16(VDD) ICLEDB6.16(VDD) ICLEDB7.16(VDD) ICLEDG0.16(VDD) ICLEDG1.16(VDD) ICLEDG2.16(VDD) ICLEDG3.16(VDD) ICLEDG4.16(VDD) ICLEDG5.16(VDD) ICLEDG6.16(VDD) ICLEDG7.16(VDD) ICLEDR0.16(VDD) ICLEDR1.16(VDD) ICLEDR2.16(VDD) ICLEDR3.16(VDD) ICLEDR4.16(VDD) ICLEDR5.16(VDD) ICLEDR6.16(VDD) ICLEDR7.16(VDD) ; also sheet 1,2,3
Unconnected: ICLEDB0.14(SDO) ICLEDB1.14(SDO) ICLEDB2.14(SDO) ICLEDB3.14(SDO) ICLEDB4.14(SDO) ICLEDB5.14(SDO) ICLEDB6.14(SDO) ICLEDB7.14(SDO) ICLEDG0.14(SDO) ICLEDG1.14(SDO) ICLEDG2.14(SDO) ICLEDG3.14(SDO) ICLEDG4.14(SDO) ICLEDG5.14(SDO) ICLEDG6.14(SDO) ICLEDG7.14(SDO) ICLEDR0.14(SDO) ICLEDR1.14(SDO) ICLEDR2.14(SDO) ICLEDR3.14(SDO) ICLEDR4.14(SDO) ICLEDR5.14(SDO) ICLEDR6.14(SDO) ICLEDR7.14(SDO)

## Library data of the parts
ARRAY1-ARRAY16 = rgb_cube:LED_RGB_5MM
C1 C2 C13 C14 C19 C20 C22 C23 C25 C26 C29 C30 C32 C33 C35 C36 = rgb_cube:CAP: Capacitor Standard 0603 ceramic capacitor, and 0.1" leaded capacitor.
C3 C4 C7-C12 C15 C17 = pixhawk2:CAP: Capacitor Standard 0603 ceramic capacitor, and 0.1" leaded capacitor.
C6 C27 = pixhawk2:CAP_POL: Capacitor Polarized These are standard SMD and PTH capacitors. Normally 10uF, 47uF, and 100uF in electrolytic and tantalum varieties. Always verify the external diameter of the through hole cap, it varies with capacity, voltage, and manufacturer. The EIA devices should be standard.
C18 = resistor:C-EU: CAPACITOR, European symbol
D1 = pixhawk2:DIODE-SCHOTTKY: Schottky barrier diode in DO214AC, e.g. Fairchild SS14.
IC1 = rgb_cube:74123
IC2 = rgb_cube:74*138: 3-line to 8-line DECODER/DEMULTIPLEXER
IC3 = rgb_cube:74540
ICLEDB0 ICLEDB1-ICLEDB7 ICLEDG0 ICLEDG1-ICLEDG7 ICLEDR0 ICLEDR1-ICLEDR7 = rgb_cube:STP08DP05
J5 = pixhawk2:MOLEX-47346-0001: MICRO USB B, BOTTOM MOUNT
J6 = pixhawk2:ARM_MINI_JTAG: CONNECTOR wire to board 1.25 mm (.049 inch) pitch header
JP1 = pixhawk2:JUMPER-3
L8 = pixhawk2:INDUCTOR: Inductors Basic Inductor/Choke - 0603 and 1206. Footprints are not proven and vary greatly between part numbers.
LED1-LED3 = pixhawk2:LED: LEDs Standard schematic elements and footprints for 5mm, 3mm, 1206, and 0603 sized LEDs. 5mm - Spark Fun Electronics SKU : COM-00529 (and others)
Q1-Q8 = transistor-power:IRF?5305: HEXFET Power MOSFET Source: http://www.irf.com/product-info/datasheets/data/irfr5305pbf.pdf
R5 R6 R8 R13-R16 R18 = pixhawk2:RESISTOR: Resistor Basic schematic elements and footprints for 0603, 1206, and PTH 1/10th watt (small) resistors.
R19 RB0 RB1-RB7 RG0 RG1-RG7 RR0 RR1-RR7 = rgb_cube:RESISTOR: Resistor Basic schematic elements and footprints for 0603, 1206, and PTH 1/10th watt (small) resistors.
RN1 = pixhawk2:CTS742C083: Chip Resistor Array 4 Single Resistor Source: http://www.ctscorp.com/components/Datasheets/CTSChipArrayDs.pdf; OC_FARNELL: unknown; OC_NEWARK: unknown
S1 = pixhawk2:SWITCH-MOMENTARY-2
U1 = pixhawk2:STM32F20X_TQFP64: STM32F20x 64pin LQFP
U6 = pixhawk2:LD1117A: LD1117A LDO Datasheet: http://www.st.com/stonline/books/pdf/docs/7194.pdf
U13 = pixhawk2:SF-MICROSD
U$1-U$4 = pixhawk2:MOUNT-HOLE
X1 = pixhawk2:OSCILLATOR: Crystal Oscillator in 3.2x2.5 SMD

## Net classes
0 signal: width 0.203 mm, drill 0.3 mm, clearance 0.203 mm
1 power: width 0.254 mm, drill 0.3 mm, clearance 0.203 mm

## Board
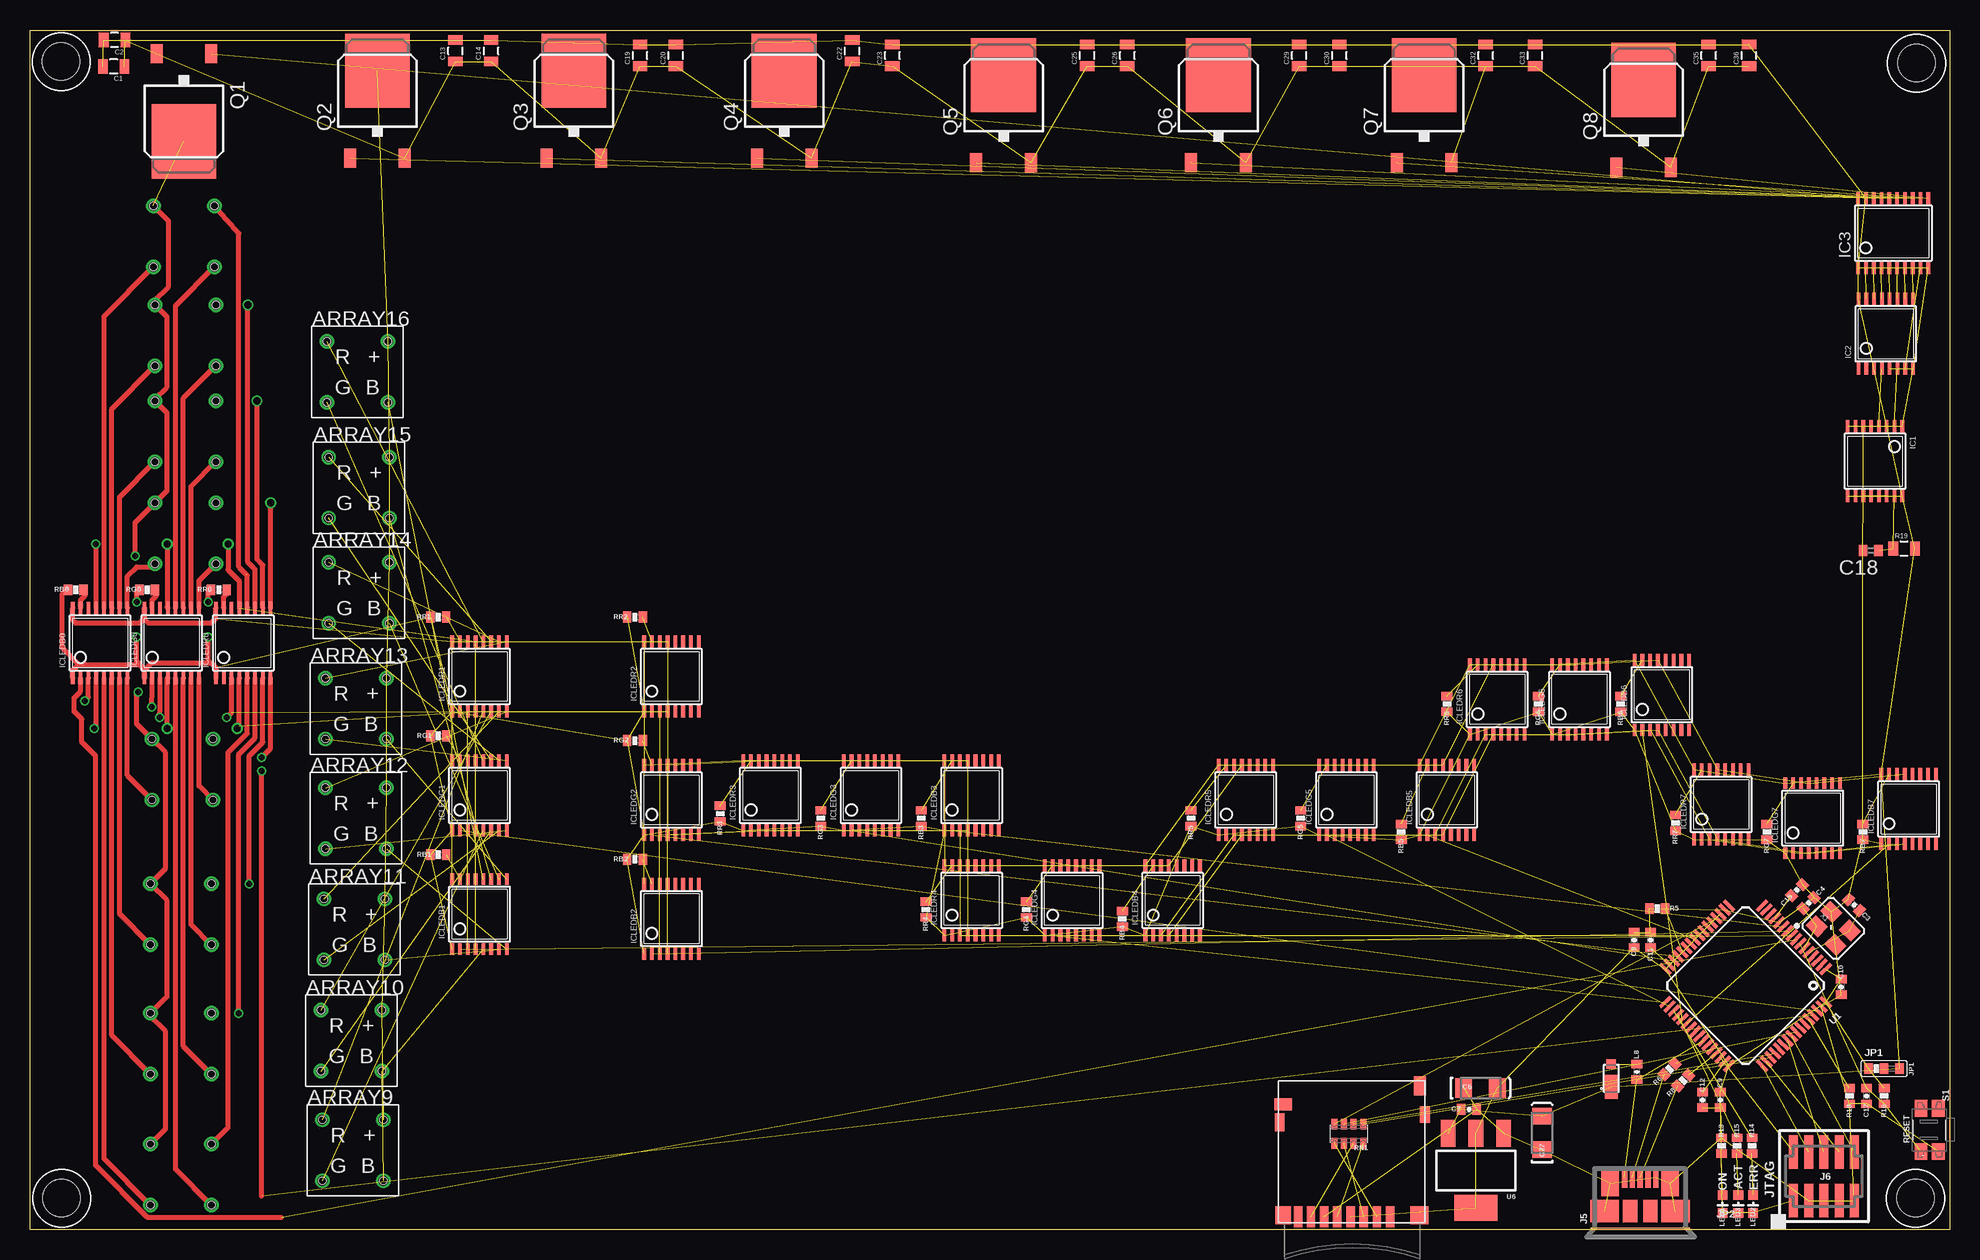
[diagram p4: board, top side]
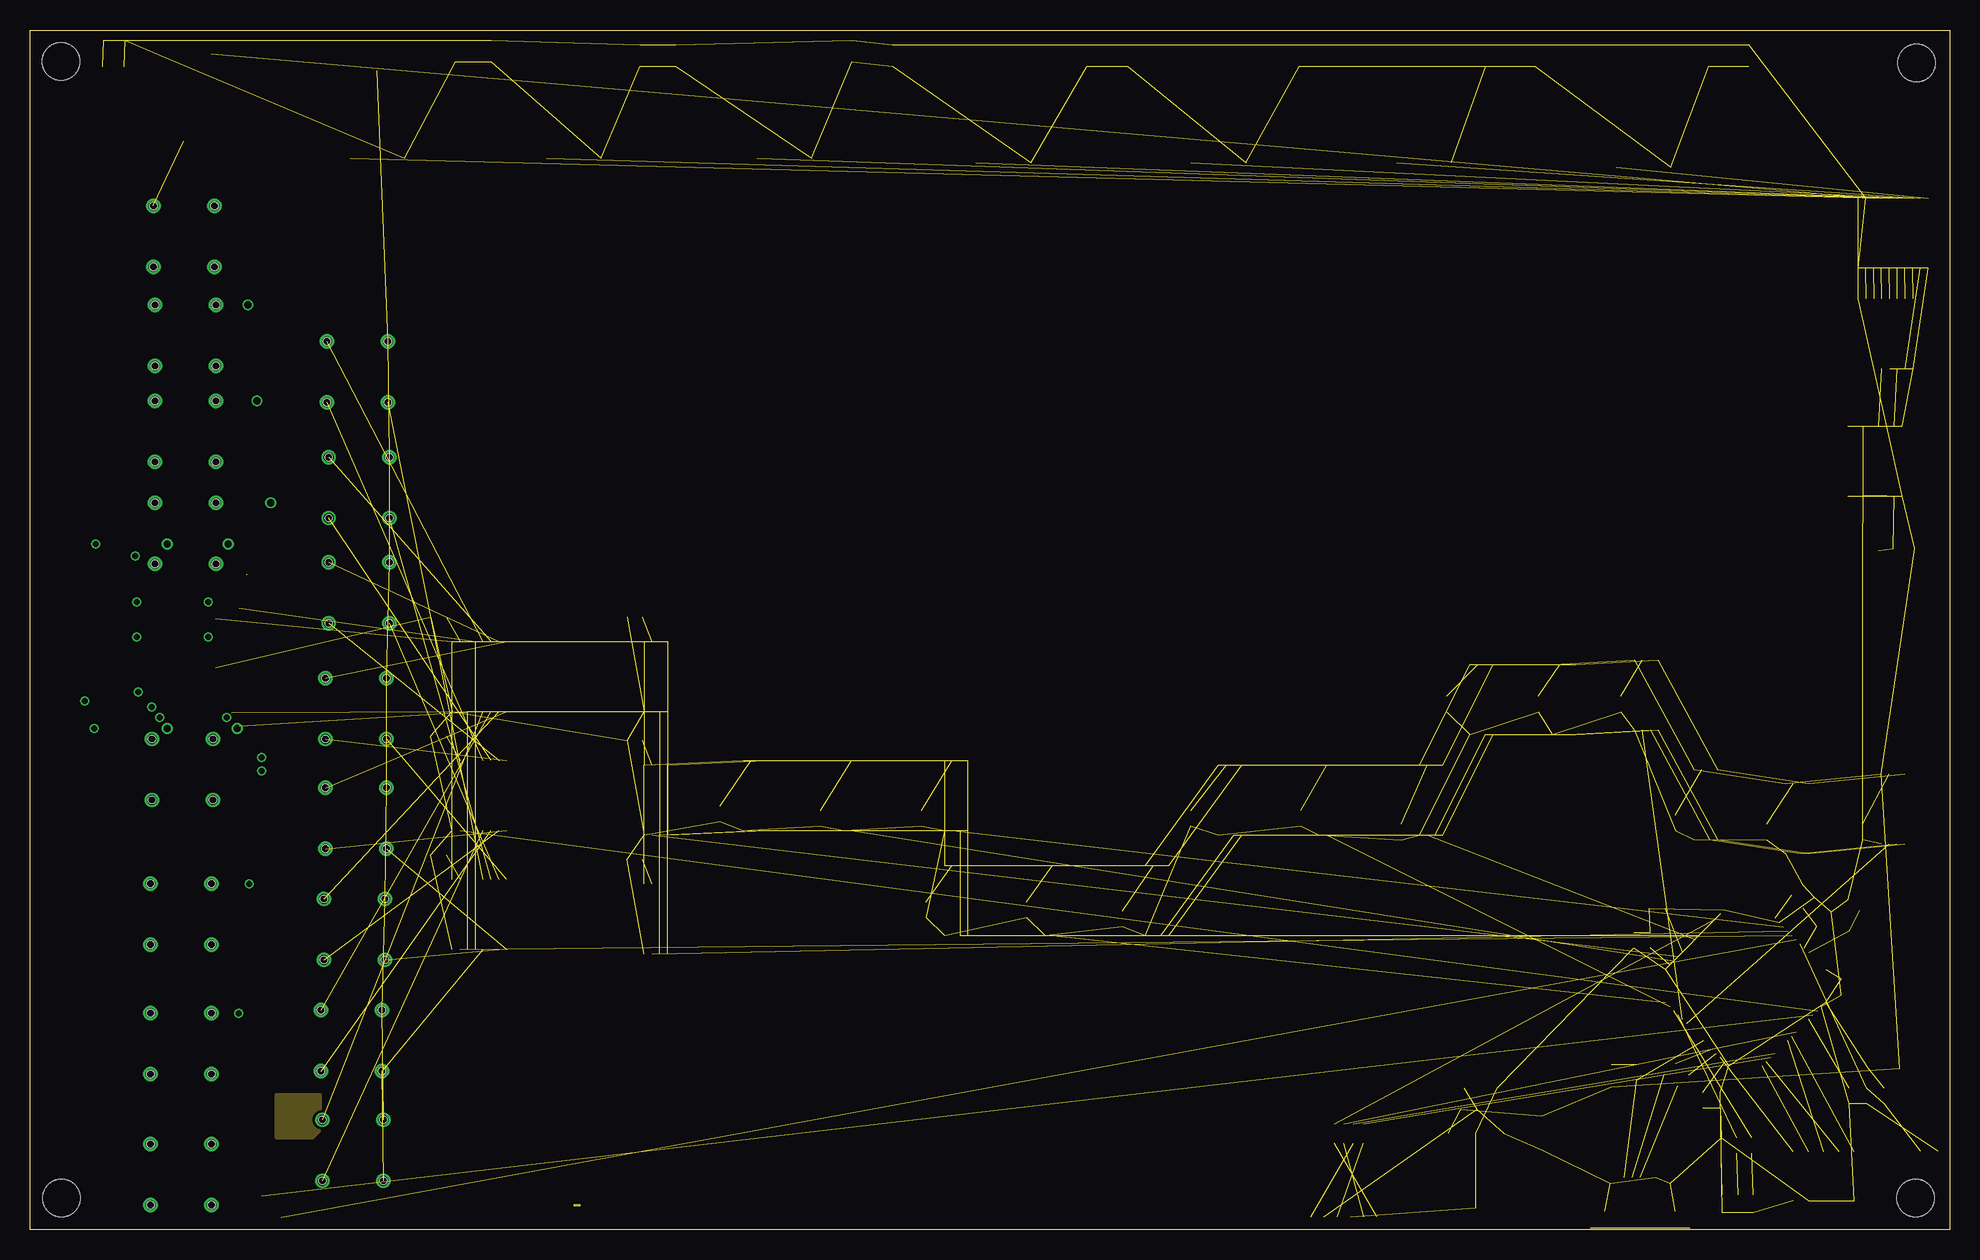
[diagram p5: board, inner layer Route2]
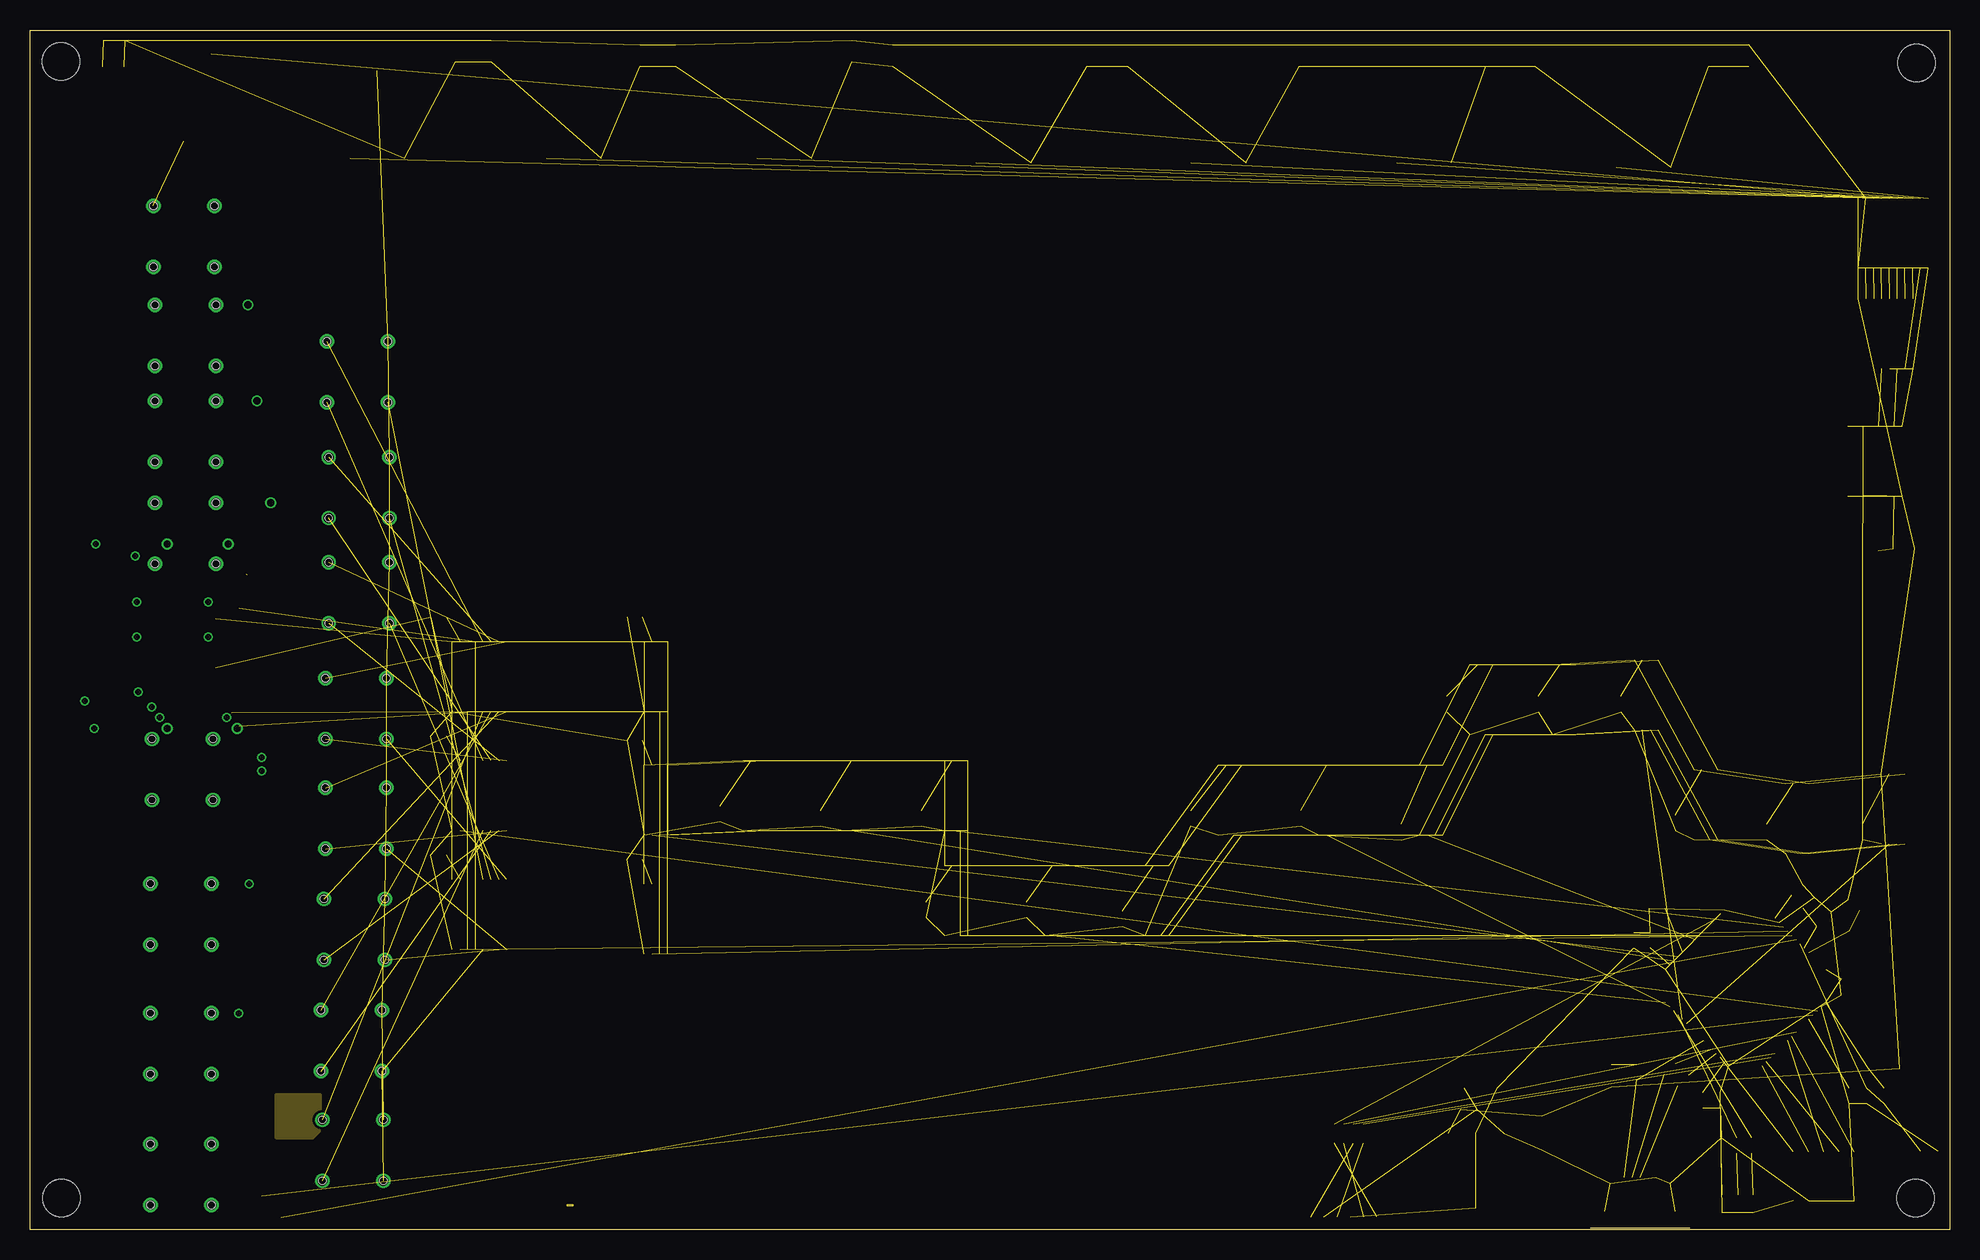
[diagram p6: board, inner layer Route15]
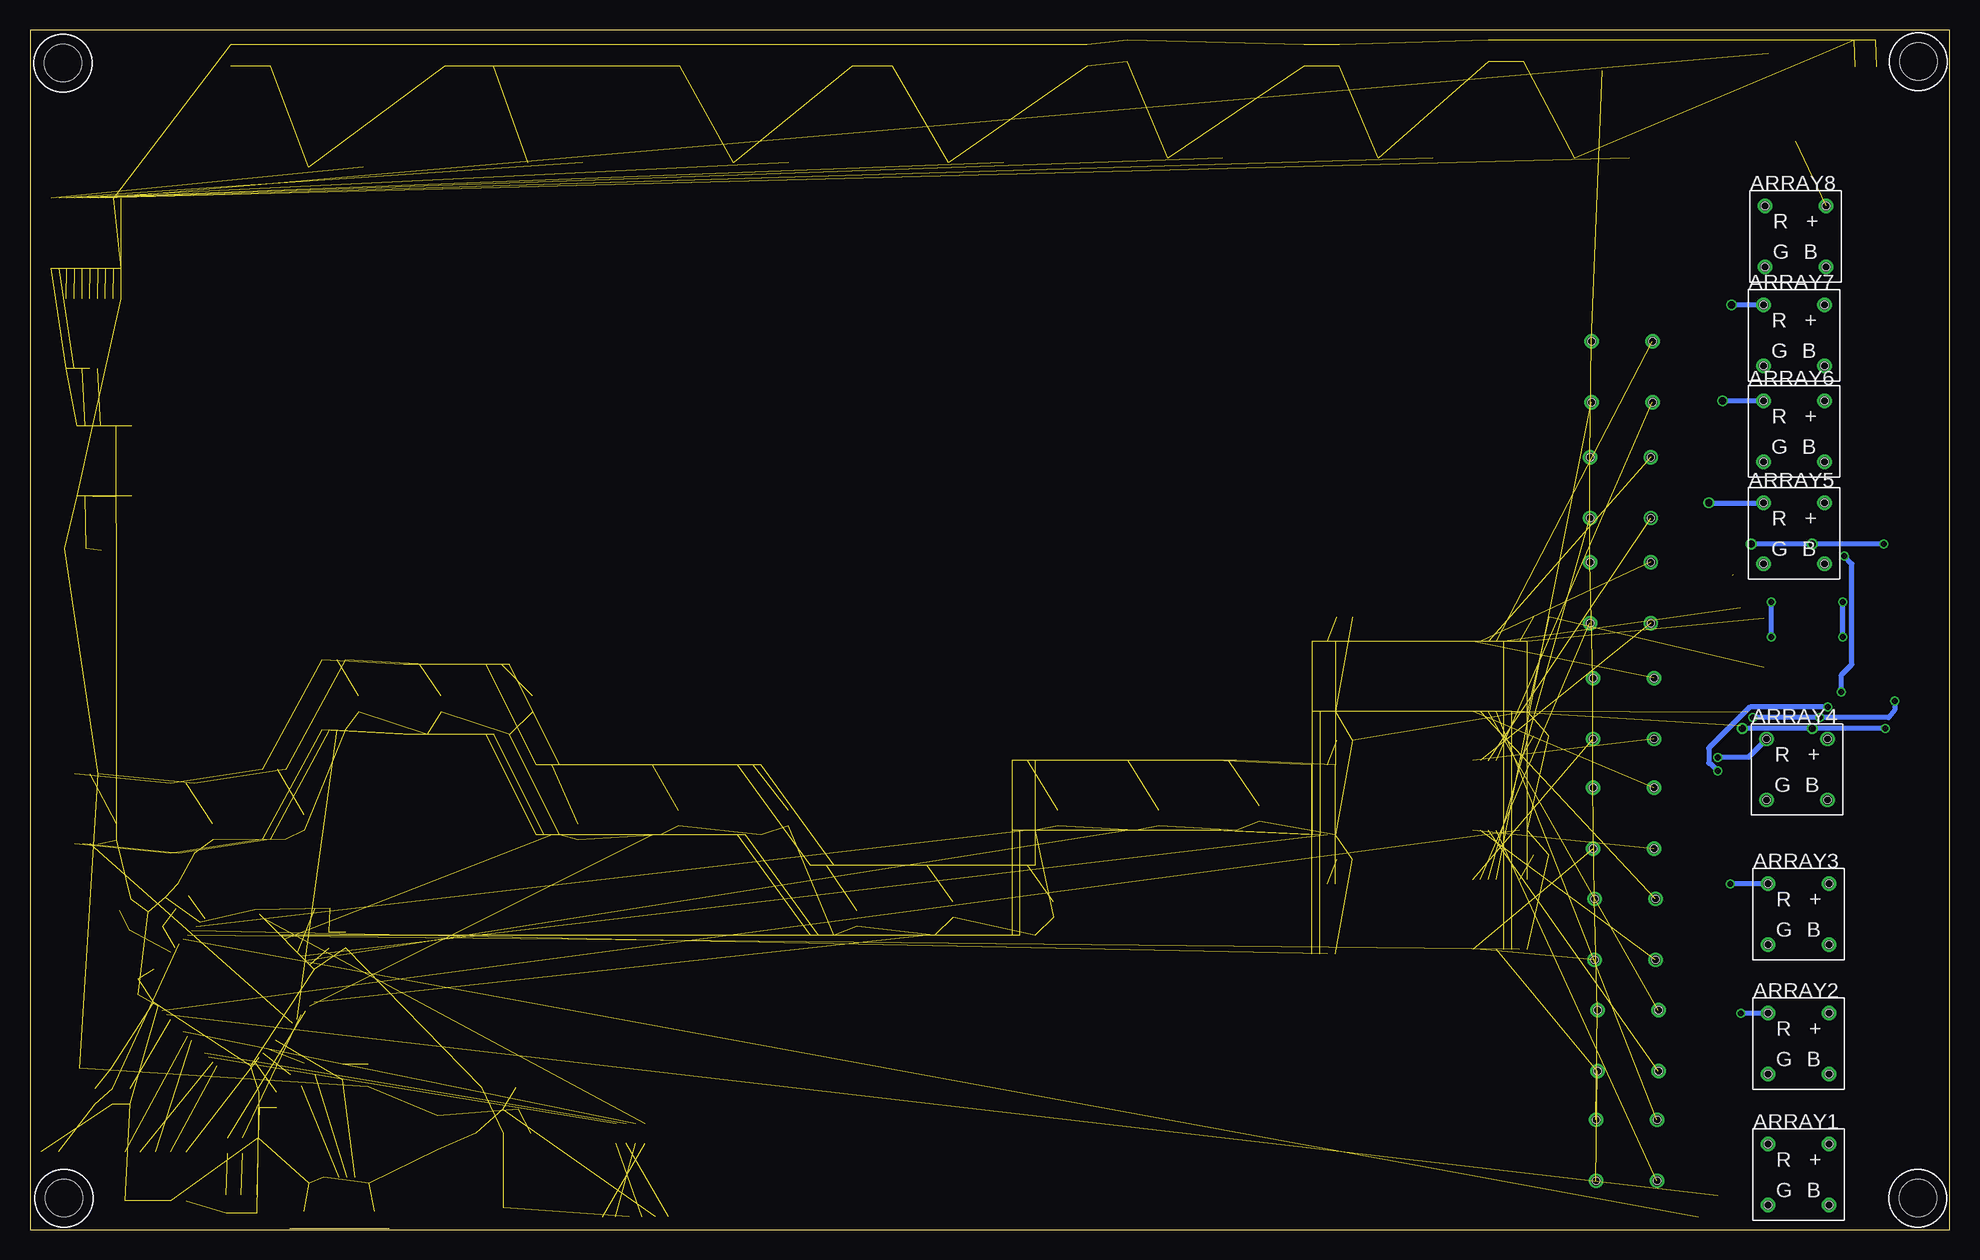
[diagram p7: board, bottom side, seen from below]

Size 160 x 100 mm. Coordinates in mm from the lower left corner, seen from the top.
Outline: 0,0 0,100 160,100 160,0 0,0
Copper layers (1*2*15*16): Top 0.035mm / dielectric 0.5mm / Route2 0.035mm / dielectric 0.5mm / Route15 0.035mm / dielectric 0.5mm / Bottom 0.035mm
Design rules "pixhawk2": minimum track width 0.15mm, minimum drill 0.3mm, track to track 0.15mm, track to pad 0.15mm, pad to pad 0.15mm, via to via 0.15mm, smd to smd 0.15mm, copper to edge 0.2mm, drill to drill 0.2mm, minimum pad ring 0.125mm, minimum via ring 0.125mm, stop-mask expansion 1mil, vias tented up to drill 0.31mm, thermal gap 8mil

### Footprints (pad centres in the part's own frame; a part is rotated, then mirrored left to right if it is on the bottom)
LED_RGB_5MM_RAD = drill 0.8 round: A 2.54,2.54; B 2.54,-2.54; G -2.54,-2.54; R -2.54,2.54 | hole 0.6: -2.54,2.54; 2.54,2.54; 2.54,-2.54; -2.54,-2.54
0805 = smd 0.8 x 1.2: 1 -0.9,0; 2 0.9,0
0402-CAP = smd 0.7 x 0.9: 1 -0.65,0; 2 0.65,0
EIA3216 = smd 1.4 x 1.6: A 1.4,0; C -1.4,0
C0402 = smd 0.7 x 0.9: 1 -0.65,0; 2 0.65,0
MICROSMP = smd 0.8 x 0.8: ANODE 0.65,0 | smd 2 x 1.1: CATHODE -1.25,0
TSSOP-16 = smd 0.305 x 0.991: 1 -2.275,-2.918; 2 -1.625,-2.918; 3 -0.975,-2.918; 4 -0.325,-2.918; 5 0.325,-2.918; 6 0.975,-2.918; 7 1.625,-2.918; 8 2.275,-2.918; 9 2.275,2.918; 10 1.625,2.918; 11 0.975,2.918; 12 0.325,2.918; 13 -0.325,2.918; 14 -0.975,2.918; 15 -1.625,2.918; 16 -2.275,2.918
TSSOP-20 = smd 0.305 x 0.991: 1 -2.305,-2.918; 2 -1.655,-2.918; 3 -1.005,-2.918; 4 -0.355,-2.918; 5 0.295,-2.918; 6 0.945,-2.918; 7 1.595,-2.918; 8 2.245,-2.918; 9 2.895,-2.918; 10 3.545,-2.918; 11 3.545,2.918; 12 2.895,2.918; 13 2.245,2.918; 14 1.595,2.918; 15 0.945,2.918; 16 0.295,2.918; 17 -0.355,2.918; 18 -1.005,2.918; 19 -1.655,2.918; 20 -2.305,2.918
MOLEX-47346-0001 = smd 1.7 x 0.44: D+ 2.8,0; D- 2.8,0.65; GND 2.8,-1.3; ID 2.8,-0.65; VBUS 2.8,1.3 | smd 1.9 x 2.375: GND1 0,2.95; GND4 0,-2.95 | smd 2.1 x 1.475: GND2 2.3,2.5; GND3 2.3,-2.5 | smd 1.9 x 1.175: GND5 0,-0.838; GND6 0,0.838
FTSH-105-01-XXX-DV-K = smd 0.737 x 2.794: 1 -2.54,-2.032; 2 -2.54,2.032; 3 -1.27,-2.032; 4 -1.27,2.032; 5 0,-2.032; 6 0,2.032; 7 1.27,-2.032; 8 1.27,2.032; 9 2.54,-2.032; 10 2.54,2.032
SJ_3_0603_PASTE1&2 = smd 0.7 x 0.9: 1 -0.65,0; 2 0.65,0; 3 1.95,0
0402-IND = smd 0.7 x 0.9: 1 -0.65,0; 2 0.65,0
LED-0603 = smd 0.8 x 0.8: A 0,-0.75; C 0,0.75
D-PAK_TO252AA = smd 1 x 1.6: 1 -2.28,-4.8; 3 2.28,-4.8 | smd 5.4 x 6.2: 4 0,2.5
0402-RES = smd 0.7 x 0.9: 1 -0.65,0; 2 0.65,0
CTS742C083 = smd 0.5 x 0.9: 1 -1.2,-0.8; 2 -0.4,-0.8; 3 0.4,-0.8; 4 1.2,-0.8; 5 1.2,0.8; 6 0.4,0.8; 7 -0.4,0.8; 8 -1.2,0.8
EVQP7J01K = smd 1.4 x 1.05: A1 -1.8,0.725; A2 1.8,0.725; B3 -1.8,-0.725; B4 1.8,-0.725
TQFP64 = smd 1.2 x 0.29: 1 -5.7,3.75; 2 -5.7,3.25; 3 -5.7,2.75; 4 -5.7,2.25; 5 -5.7,1.75; 6 -5.7,1.25; 7 -5.7,0.75; 8 -5.7,0.25; 9 -5.7,-0.25; 10 -5.7,-0.75; 11 -5.7,-1.25; 12 -5.7,-1.75; 13 -5.7,-2.25; 14 -5.7,-2.75; 15 -5.7,-3.25; 16 -5.7,-3.75; 33 5.7,-3.75; 34 5.7,-3.25; 35 5.7,-2.75; 36 5.7,-2.25; 37 5.7,-1.75; 38 5.7,-1.25; 39 5.7,-0.75; 40 5.7,-0.25; 41 5.7,0.25; 42 5.7,0.75; 43 5.7,1.25; 44 5.7,1.75; 45 5.7,2.25; 46 5.7,2.75; 47 5.7,3.25; 48 5.7,3.75 | smd 0.29 x 1.2: 17 -3.75,-5.7; 18 -3.25,-5.7; 19 -2.75,-5.7; 20 -2.25,-5.7; 21 -1.75,-5.7; 22 -1.25,-5.7; 23 -0.75,-5.7; 24 -0.25,-5.7; 25 0.25,-5.7; 26 0.75,-5.7; 27 1.25,-5.7; 28 1.75,-5.7; 29 2.25,-5.7; 30 2.75,-5.7; 31 3.25,-5.7; 32 3.75,-5.7; 49 3.75,5.7; 50 3.25,5.7; 51 2.75,5.7; 52 2.25,5.7; 53 1.75,5.7; 54 1.25,5.7; 55 0.75,5.7; 56 0.25,5.7; 57 -0.25,5.7; 58 -0.75,5.7; 59 -1.25,5.7; 60 -1.75,5.7; 61 -2.25,5.7; 62 -2.75,5.7; 63 -3.25,5.7; 64 -3.75,5.7
SOT-223 = smd 1.219 x 2.235: 1 -2.311,-3.099; 2 0,-3.099; 3 2.311,-3.099 | smd 3.6 x 2.2: 4 0,3.099
AMPHENOL_114-00841-68 = smd 0.7 x 1.75: P$1 7.7,-1; P$2 6.6,-1; P$3 5.5,-1; P$4 4.4,-1; P$5 3.3,-1; P$6 2.2,-1; P$7 1.1,-1; P$8 0.04,-1 | smd 1.5 x 1.5: P$9 10.15,-0.9 | smd 1.3 x 1.5: P$10 -1.2,-0.9 | smd 0.8 x 1.5: P$11 -1.5,6.85 | smd 1.45 x 1: P$12 -1.2,8.35 | smd 0.8 x 1.4: P$13 10.6,7.5 | smd 1 x 1.55: P$14 10.2,9.9
MOUNT-HOLE3.1 = hole 3.1: 0,0
OSCILLATOR-3.2X2.5 = smd 1.4 x 1.2: 1 -1.1,-0.85; 2 1.1,-0.85; 3 1.1,0.85; 4 -1.1,0.85

### Placement (x,y rotation side)
ARRAY1  12.57,4.57 0 bottom
ARRAY2  12.57,15.49 0 bottom
ARRAY3  12.57,26.29 0 bottom
ARRAY4  12.7,38.35 0 bottom
ARRAY5  12.95,58.04 0 bottom
ARRAY6  12.95,66.55 0 bottom
ARRAY7  12.95,74.55 0 bottom
ARRAY8  12.83,82.8 0 bottom
ARRAY9  26.92,6.6 0 top
ARRAY10  26.8,15.75 0 top
ARRAY11  27.05,25.02 0 top
ARRAY12  27.18,34.29 0 top
ARRAY13  27.18,43.43 0 top
ARRAY14  27.43,53.09 0 top
ARRAY15  27.43,61.85 0 top
ARRAY16  27.3,71.5 0 top
C1  6.97,96.95 180 top
C2  7.05,99.16 180 top
C3  152.04,27.06 135 top
C4  148.26,27.21 225 top
C6  120.9,11.79 0 top
C7  119.94,10.02 0 top
C8  133.71,24.14 90 top
C9  140.89,10.8 270 top
C10  150.97,20.23 270 top
C11  135.08,24.14 90 top
C12  139.42,10.8 270 top
C13  35.46,98.26 90 top
C14  38.43,98.26 90 top
C15  147.29,28.3 45 top
C17  153.09,11.13 90 top
C18  153.43,56.61 180 top
C19  50.85,97.88 90 top
C20  53.83,97.88 90 top
C22  68.53,98.26 90 top
C23  71.89,97.88 90 top
C25  88.12,97.88 90 top
C26  91.47,97.88 90 top
C27  126.03,8.06 90 top
C29  105.79,97.88 90 top
C30  109.15,97.88 90 top
C32  121.34,97.88 90 top
C33  125.45,97.88 90 top
C35  139.93,97.88 90 top
C36  143.28,97.88 90 top
D1  131.8,13.14 90 top
IC1  153.79,64.05 180 top
IC2  154.69,74.68 0 top
IC3  154.69,83.06 0 top
ICLEDB0  5.84,48.9 0 top
ICLEDB1  37.47,26.29 0 top
ICLEDB2  53.47,25.91 0 top
ICLEDB3  78.49,36.2 0 top
ICLEDB4  95.25,27.43 0 top
ICLEDB5  118.11,35.81 0 top
ICLEDB6  136.02,44.58 0 top
ICLEDB7  156.59,35.05 0 top
ICLEDG0  11.81,48.9 0 top
ICLEDG1  37.47,36.2 0 top
ICLEDG2  53.47,35.81 0 top
ICLEDG3  70.1,36.2 0 top
ICLEDG4  86.87,27.43 0 top
ICLEDG5  109.73,35.81 0 top
ICLEDG6  129.16,44.2 0 top
ICLEDG7  148.59,34.29 0 top
ICLEDR0  17.78,48.9 0 top
ICLEDR1  37.47,46.1 0 top
ICLEDR2  53.47,46.1 0 top
ICLEDR3  61.72,36.2 0 top
ICLEDR4  78.49,27.43 0 top
ICLEDR5  101.35,35.81 0 top
ICLEDR6  122.3,44.2 0 top
ICLEDR7  140.97,35.43 0 top
J5  134.21,1.54 90 top
J6  149.53,4.45 0 top
JP1  153.9,13.42 0 top
L8  133.93,13.14 270 top
LED1  141.07,2.14 0 top
LED2  143.64,2.14 0 top
LED3  142.39,2.14 0 top
Q1  12.83,93.22 180 top
Q2  28.96,94.11 0 top
Q3  45.34,94.11 0 top
Q4  62.87,94.11 0 top
Q5  81.15,93.73 0 top
Q6  99.06,93.73 0 top
Q7  116.2,93.73 0 top
Q8  134.49,93.34 0 top
R5  135.64,26.75 180 top
R6  136.67,13.38 45 top
R8  137.81,12.43 45 top
R13  141,6.99 270 top
R14  143.54,6.99 270 top
R15  142.29,6.99 270 top
R16  154.56,11.13 90 top
R18  151.66,11.13 90 top
R19  156.21,56.77 0 top
RB0  3.81,53.34 0 top
RB1  34.04,31.24 0 top
RB2  50.42,30.86 0 top
RB3  74.3,34.29 90 top
RB4  91.06,25.91 90 top
RB5  114.3,33.15 90 top
RB6  132.59,43.81 90 top
RB7  152.78,33.15 90 top
RG0  9.78,53.34 0 top
RG1  34.04,41.15 0 top
RG2  50.42,40.77 0 top
RG3  65.91,34.29 90 top
RG4  83.06,26.67 90 top
RG5  105.92,34.29 90 top
RG6  125.73,43.81 90 top
RG7  144.78,33.15 90 top
RN1  109.93,7.99 180 top
RR0  15.75,53.34 0 top
RR1  34.04,51.05 0 top
RR2  50.42,51.05 0 top
RR3  57.53,34.67 90 top
RR4  74.68,26.67 90 top
RR5  96.77,34.29 90 top
RR6  118.11,43.81 90 top
RR7  137.16,33.91 90 top
S1  158.34,8.31 90 top
U1  143,20.33 225 top
U6  120.52,4.91 180 top
U13  105.67,2.08 0 top
U$1  157.17,2.62 0 top
U$2  2.64,2.62 0 top
U$3  2.6,97.36 0 top
U$4  157.25,97.23 0 top
X1  150.32,25.1 315 top

### Tracks (layer width: path | path; a pad name or v marks a point on that pad's centre or on a via)
!JTRST  (1 unrouted)
BOOT0  (1 unrouted)
E_FET0  (1 unrouted)
E_FET1  (1 unrouted)
E_FET2  (1 unrouted)
E_FET3  (1 unrouted)
E_FET4  (1 unrouted)
E_FET5  (1 unrouted)
E_FET6  (1 unrouted)
E_FET7  (1 unrouted)
FET_EN  (1 unrouted)
GND  (via drill 0.5)  (101 unrouted)
  Top 0.406: 3.57,46.73 ICLEDB0.1 3.57,46.62 4.06,47.12 | 4.06,47.12 9.14,47.12 | 9.14,47.12 9.53,46.74 9.53,45.99 ICLEDG0.1 9.54,46.62 10.16,47.24 14.73,47.24 | 14.73,47.24 15.11,47.24 15.49,46.86 15.49,45.99 ICLEDR0.1 | RG0.1 8.88,53.1 v8.89,52.32 | v8.89,49.4 8.89,47.37 9.14,47.12 | RR0.1 14.86,53.34 v14.86,52.32 | v14.86,49.4 14.86,47.37 14.73,47.24 | 4.06,47.12 2.67,48.51 2.67,52.96 3.05,53.34 RB0.1
  Bottom 0.406: v8.89,49.4 v8.89,52.32 | v14.86,49.4 v14.86,52.32
JTCK-SWCLK  (1 unrouted)
JTDI  (1 unrouted)
JTDO  (1 unrouted)
JTMS-SWDIO  (1 unrouted)
LED_AMBER  (1 unrouted)
LED_B0_0
  Top 0.406: ICLEDB0.5 6.17,5.9 ARRAY1.B
LED_B0_1
  Top 0.406: ICLEDB0.6 6.82,16.17 ARRAY2.B
LED_B0_2
  Top 0.406: ICLEDB0.7 7.47,26.32 ARRAY3.B
LED_B0_3
  Top 0.406: ICLEDB0.8 8.12,37.86 ARRAY4.B
LED_B0_4
  Top 0.406: ICLEDB0.9 8.12,54.47 8.89,55.24 10.16,55.24 ARRAY5.B
LED_B0_5
  Top 0.406: ICLEDB0.10 7.47,61.06 ARRAY6.B
LED_B0_6
  Top 0.406: ICLEDB0.11 6.82,68.41 ARRAY7.B
LED_B0_7
  Top 0.406: ICLEDB0.12 6.17,76.14 ARRAY8.B
LED_B1_0  (2 unrouted)
LED_B1_2  (1 unrouted)
LED_B1_3  (1 unrouted)
LED_B1_4  (1 unrouted)
LED_B1_5  (1 unrouted)
LED_B1_6  (1 unrouted)
LED_B1_7  (1 unrouted)
LED_BLUE  (1 unrouted)
LED_CLK  (via drill 0.5)  (21 unrouted)
  Top 0.406: ICLEDB0.3 4.87,44.36 v4.57,44.07 | v10.79,42.67 10.84,43.6 ICLEDG0.3 | ICLEDR0.3 16.8,43.09 v16.38,42.67
  Bottom 0.406: v4.57,44.07 4.57,43.31 5.08,42.67 v10.79,42.67 v16.38,42.67
LED_G0_0
  Top 0.406: ICLEDG0.5 12.14,5.01 ARRAY1.G
LED_G0_1
  Top 0.406: ICLEDG0.6 12.79,15.28 ARRAY2.G
LED_G0_2
  Top 0.406: ICLEDG0.7 13.44,25.43 ARRAY3.G
LED_G0_3
  Top 0.406: ICLEDG0.8 14.09,36.97 ARRAY4.G
LED_G0_4
  Top 0.406: ICLEDG0.9 14.09,54.09 ARRAY5.G
LED_G0_5
  Top 0.406: ICLEDG0.10 13.44,61.95 ARRAY6.G
LED_G0_6
  Top 0.406: ICLEDG0.11 12.79,69.3 ARRAY7.G
LED_G0_7
  Top 0.406: ICLEDG0.12 12.14,77.03 ARRAY8.G
LED_G1_0  (1 unrouted)
LED_G1_1  (1 unrouted)
LED_G1_2  (1 unrouted)
LED_G1_3  (1 unrouted)
LED_G1_4  (1 unrouted)
LED_G1_5  (1 unrouted)
LED_G1_6  (1 unrouted)
LED_G1_7  (1 unrouted)
LED_GRP0  (via drill 0.5)  (1 unrouted)
  Top 0.406: ARRAY3.A 11.3,30.1 11.3,39.75 ARRAY4.A 8.89,42.16 8.89,44.7 v9.02,44.83 | ARRAY3.A 9.91,28.83 | ARRAY3.A 11.43,27.43 11.43,19.43 ARRAY2.A 10.03,17.78 11.3,16.51 11.3,8.38 ARRAY1.A | ARRAY8.A 11.56,84.07 11.56,78.61 10.41,77.47 ARRAY7.A 11.43,76.07 11.43,70.23 10.41,69.22 ARRAY6.A 11.43,68.07 11.43,61.59 ARRAY5.A 8.76,58.93 v8.76,56.13
  Bottom 0.406: 9.02,45.09 v9.02,44.83 9.02,46.23 8.13,47.12 8.13,55.5 v8.76,56.13
LED_GRP1  (8 unrouted)
LED_I_B0  (1 unrouted)
  Top 0.406: ICLEDB0.2 4.22,44.86 3.68,44.32 3.68,43.18 4.32,42.55 4.32,40.64 5.46,39.5 5.46,5.33 9.78,1.02 20.95,1.02
LED_I_B1  (1 unrouted)
LED_I_B2  (1 unrouted)
LED_I_B3  (1 unrouted)
LED_I_B4  (1 unrouted)
LED_I_B5  (1 unrouted)
LED_I_B6  (1 unrouted)
LED_I_B7  (1 unrouted)
LED_I_G0  (via drill 0.5)  (1 unrouted)
  Top 0.406: ICLEDG0.2 10.19,45.11 v10.16,43.56 | 19.3,2.79 v19.3,38.23
  Bottom 0.406: v10.16,43.56 16.64,43.56 20.07,40.13 20.07,38.86 19.94,38.86 v19.3,38.23
LED_I_G1  (1 unrouted)
LED_I_G2  (1 unrouted)
LED_I_G3  (1 unrouted)
LED_I_G4  (1 unrouted)
LED_I_G5  (1 unrouted)
LED_LE  (via drill 0.5, 0.6)  (21 unrouted)
  Top 0.406: ICLEDR0.4 17.45,41.97 v17.27,41.78 | v11.43,41.78 11.43,45.92 ICLEDG0.4 | ICLEDB0.4 5.52,41.84 v5.33,41.78
  Bottom 0.406: v17.27,41.78 v11.43,41.78 v5.33,41.78
LED_OE  (via drill 0.5, 0.6)  (21 unrouted)
  Top 0.406: ICLEDR0.13 17.45,54.05 16.51,54.99 v16.51,57.15 | v11.43,57.15 11.43,51.87 ICLEDG0.13 | ICLEDB0.13 5.52,57.09 v5.46,57.15
  Bottom 0.406: v16.51,57.15 v11.43,57.15 v5.46,57.15
LED_R0_0
  Top 0.406: ICLEDR0.5 18.11,41.35 16.51,39.75 16.51,8.51 ARRAY1.R
LED_R0_1  (via drill 0.5)
  Top 0.406: ICLEDR0.6 18.75,40.98 17.4,39.62 v17.4,18.03
  Bottom 0.406: ARRAY2.R v17.4,18.03
LED_R0_2  (via drill 0.5)
  Top 0.406: ICLEDR0.7 19.41,40.61 18.29,39.5 v18.29,28.83
  Bottom 0.406: ARRAY3.R v18.29,28.83
LED_R0_3  (via drill 0.5)
  Top 0.406: ICLEDR0.8 20.05,40.12 v19.3,39.37
  Bottom 0.406: v19.3,39.37 16.76,39.37 ARRAY4.R
LED_R0_4  (via drill 0.6)
  Top 0.406: ICLEDR0.9 20.05,59.93 v20.07,60.58
  Bottom 0.406: v20.07,60.58 ARRAY5.R
LED_R0_5  (via drill 0.6)
  Top 0.406: ICLEDR0.10 19.41,55.4 18.92,55.88 v18.92,69.09
  Bottom 0.406: v18.92,69.09 ARRAY6.R
LED_R0_6  (via drill 0.6)
  Top 0.406: ICLEDR0.11 18.75,55.03 18.16,55.63 v18.16,77.09
  Bottom 0.406: v18.16,77.09 ARRAY7.R
LED_R0_7  (1 unrouted)
  Top 0.406: ICLEDR0.12 18.11,54.55 | 18.03,54.61 17.4,55.24 17.4,83.06 ARRAY8.R
LED_R1_0  (1 unrouted)
LED_R1_1  (1 unrouted)
LED_R1_2  (1 unrouted)
LED_R1_3  (1 unrouted)
LED_R1_4  (1 unrouted)
LED_R1_5  (1 unrouted)
LED_R1_6  (1 unrouted)
LED_R1_7  (1 unrouted)
N$1  (2 unrouted)
N$2  (2 unrouted)
N$3  (1 unrouted)
N$4
  Top 0.406: ICLEDR0.15 16.13,51.84 16.13,52.7 16.4,52.97 RR0.2
N$5  (1 unrouted)
N$6  (1 unrouted)
N$8  (1 unrouted)
N$9  (1 unrouted)
N$10  (1 unrouted)
N$11  (1 unrouted)
N$12  (1 unrouted)
N$13
  Top 0.406: ICLEDG0.15 10.19,52.48 10.54,52.83 10.54,53.2 RG0.2
N$14  (1 unrouted)
N$15
  Top 0.406: ICLEDB0.15 4.22,52.48 4.57,52.83 4.57,53.2 RB0.2
N$16  (1 unrouted)
N$18  (1 unrouted)
N$19  (1 unrouted)
N$20  (1 unrouted)
N$21  (1 unrouted)
N$23  (1 unrouted)
N$24  (1 unrouted)
N$25  (1 unrouted)
N$26  (1 unrouted)
N$27  (1 unrouted)
N$28  (1 unrouted)
N$29  (1 unrouted)
N$30  (1 unrouted)
N$31  (1 unrouted)
N$32  (1 unrouted)
N$35  (1 unrouted)
N$36  (1 unrouted)
N$40  (1 unrouted)
N$41  (1 unrouted)
N$42  (1 unrouted)
N$43  (1 unrouted)
N$45  (1 unrouted)
N$46  (1 unrouted)
N$47  (2 unrouted)
N$48  (1 unrouted)
N$49  (1 unrouted)
N$50  (1 unrouted)
N$51  (1 unrouted)
N$52  (1 unrouted)
N$53  (1 unrouted)
OTG_DM  (1 unrouted)
OTG_DP  (1 unrouted)
OTG_FS_DM  (1 unrouted)
OTG_FS_DP  (1 unrouted)
PB2-BOOT1  (1 unrouted)
POLY1
  Route15 0.203: 45.21,2.03 44.81,2.03
  pour Route2 (rank 2): 20.52,11.28 24.18,11.28 24.18,8.23 23.57,7.62 20.52,7.62
POLY2
  Route2 0.203: 45.41,2.03 45.82,2.03
  pour Route15: 20.52,11.28 24.18,11.28 24.18,8.23 23.57,7.62 20.52,7.62
RESET  (3 unrouted)
SPI3_MISO  (1 unrouted)
SPI3_MOSI  (1 unrouted)
SPI3_NSS  (1 unrouted)
SPI3_SCK  (1 unrouted)
VBUS  (2 unrouted)
VCAP_1  (1 unrouted)
VCAP_2  (1 unrouted)
VCC  (23 unrouted)
VDD_3V3  (17 unrouted)
VDD_3V3_ANALOG  (1 unrouted)
VDD_5V  (32 unrouted)
  Top 0.406: ICLEDB0.16 3.57,50.79 3.81,50.55 9.14,50.55 9.54,50.94 ICLEDG0.16 9.54,50.92 9.91,50.55 15.11,50.55 15.49,50.93 15.49,51.8 ICLEDR0.16

### Text on the board
tPlace: JP1 | RESET | JTAG | ON | ACT | ERR | JP2
tDocu: 5.0V | 5.0V | 3.3V | 3.3V